# Altium project FIT_PM_TCM_Emulator.PrjPcb (part 1 of 4)
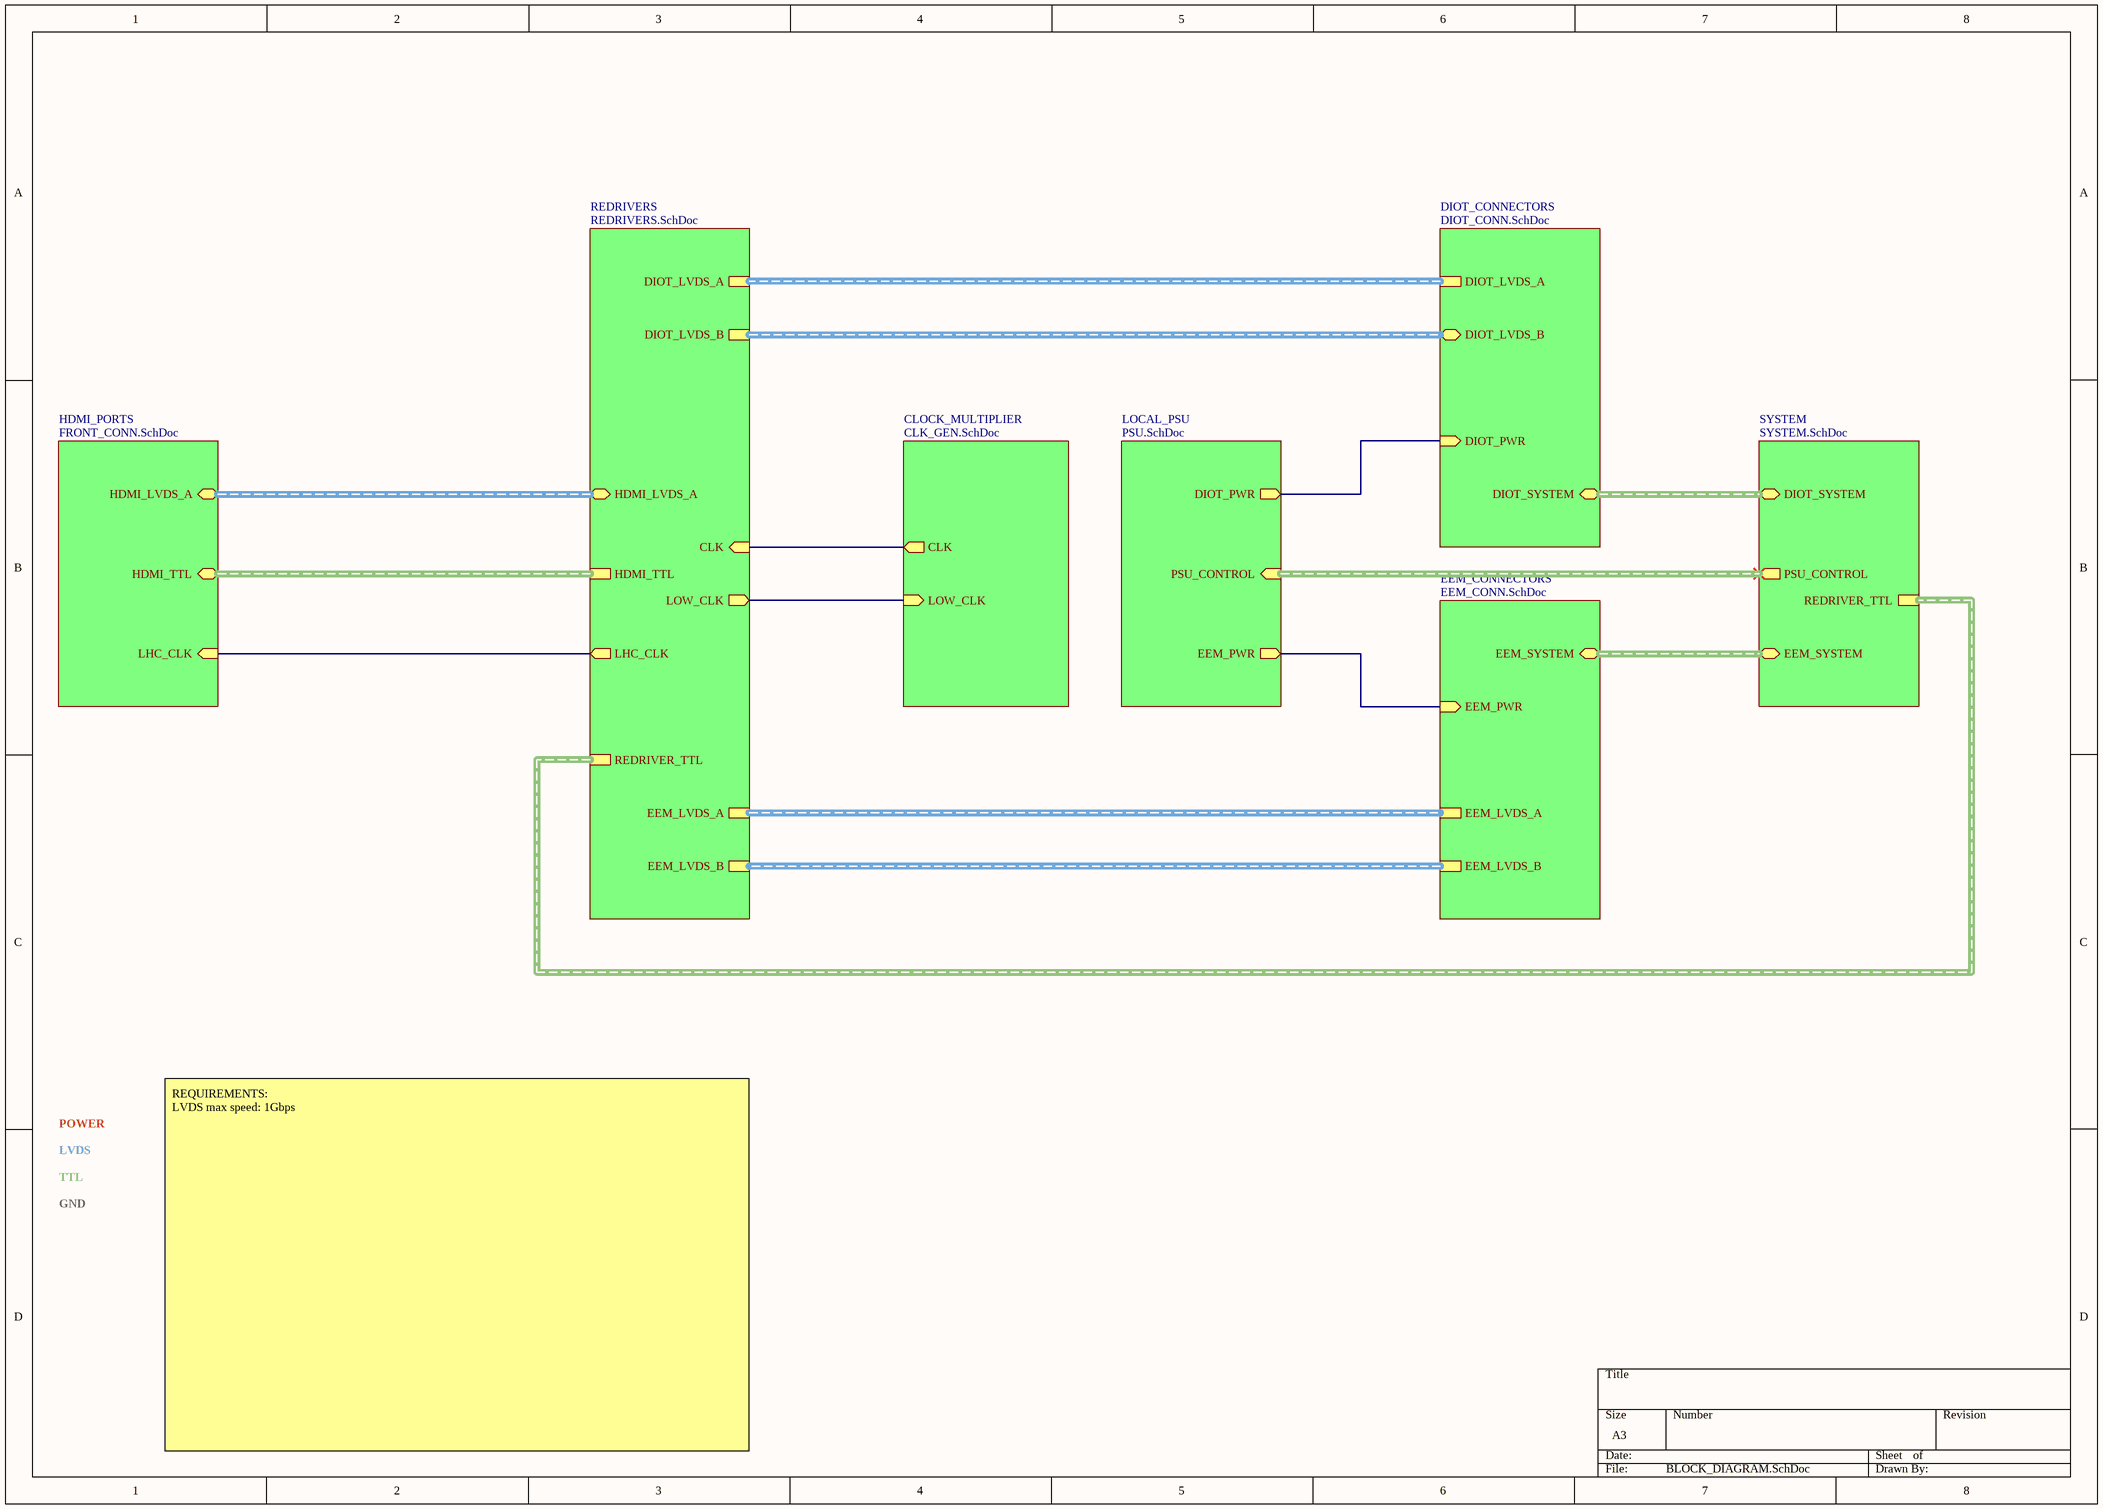
[diagram p0: BLOCK_DIAGRAM.SchDoc]
8 sheets, 255 parts. Net scope: hierarchical (ports join the sheet entries above them; power ports are global).
Board file: LVDS_EXTENDER.PcbDoc
Sheets:
  BLOCK_DIAGRAM.SchDoc
    HDMI_PORTS = FRONT_CONN.SchDoc
    REDRIVERS = REDRIVERS.SchDoc
    DIOT_CONNECTORS = DIOT_CONN.SchDoc
    EEM_CONNECTORS = EEM_CONN.SchDoc
    LOCAL_PSU = PSU.SchDoc
    SYSTEM = SYSTEM.SchDoc
    CLOCK_MULTIPLIER = CLK_GEN.SchDoc

## Sheet BLOCK_DIAGRAM.SchDoc
size A3; SheetNumber: 1; SheetTotal: 8

### Sub-sheets
CLOCK_MULTIPLIER = CLK_GEN.SchDoc: CLK (out), LOW_CLK (in)
DIOT_CONNECTORS = DIOT_CONN.SchDoc: DIOT_SYSTEM (bidir, harness DIOT_SYSTEM), DIOT_LVDS_A (harness DIOT_LVDS_A), DIOT_PWR (in), DIOT_LVDS_B (bidir)
EEM_CONNECTORS = EEM_CONN.SchDoc: EEM_SYSTEM (bidir), EEM_LVDS_B (harness EEM_LVDS), EEM_PWR (in), EEM_LVDS_A (harness EEM_LVDS_A)
HDMI_PORTS = FRONT_CONN.SchDoc: HDMI_LVDS_A (bidir), HDMI_TTL (bidir), LHC_CLK (in)
LOCAL_PSU = PSU.SchDoc: DIOT_PWR (out), EEM_PWR (out), PSU_CONTROL (in)
REDRIVERS = REDRIVERS.SchDoc: EEM_LVDS_B (harness DIOT_LVDS_B), DIOT_LVDS_A (harness DIOT_LVDS_A), HDMI_LVDS_A (bidir), HDMI_TTL, DIOT_LVDS_B (harness DIOT_LVDS_B), EEM_LVDS_A (harness EEM_LVDS_A), REDRIVER_TTL, LHC_CLK (out), CLK (in), LOW_CLK (out)
SYSTEM = SYSTEM.SchDoc: DIOT_SYSTEM (bidir, harness DIOT_SYSTEM), EEM_SYSTEM (bidir), PSU_CONTROL (out), REDRIVER_TTL

### Nets
240MHz: sheet REDRIVERS/CLK, sheet CLOCK_MULTIPLIER/CLK
EEM_12V: sheet EEM_CONNECTORS/EEM_PWR, sheet LOCAL_PSU/EEM_PWR
NetC1_2: sheet DIOT_CONNECTORS/DIOT_PWR, sheet LOCAL_PSU/DIOT_PWR
NetC67_1: sheet REDRIVERS/LOW_CLK, sheet CLOCK_MULTIPLIER/LOW_CLK
NetJ4_1: sheet HDMI_PORTS/LHC_CLK, sheet REDRIVERS/LHC_CLK

### Buses and harness runs
harness sheet DIOT_CONNECTORS/DIOT_LVDS_A = sheet REDRIVERS/DIOT_LVDS_A
harness sheet DIOT_CONNECTORS/DIOT_LVDS_B = sheet REDRIVERS/DIOT_LVDS_B
harness sheet DIOT_CONNECTORS/DIOT_SYSTEM = sheet SYSTEM/DIOT_SYSTEM
harness sheet EEM_CONNECTORS/EEM_LVDS_A = sheet REDRIVERS/EEM_LVDS_A
harness sheet EEM_CONNECTORS/EEM_LVDS_B = sheet REDRIVERS/EEM_LVDS_B
harness sheet EEM_CONNECTORS/EEM_SYSTEM = sheet SYSTEM/EEM_SYSTEM
harness sheet HDMI_PORTS/HDMI_LVDS_A = sheet REDRIVERS/HDMI_LVDS_A
harness sheet HDMI_PORTS/HDMI_TTL = sheet REDRIVERS/HDMI_TTL
harness sheet LOCAL_PSU/PSU_CONTROL = sheet SYSTEM/PSU_CONTROL
harness sheet REDRIVERS/REDRIVER_TTL = sheet SYSTEM/REDRIVER_TTL

### Notes on the sheet
- POWER
- LVDS
- TTL
- GND
- REQUIREMENTS:
  LVDS max speed: 1Gbps

## Sheet FRONT_CONN.SchDoc
size A3; SheetNumber: 3; SheetTotal: 8
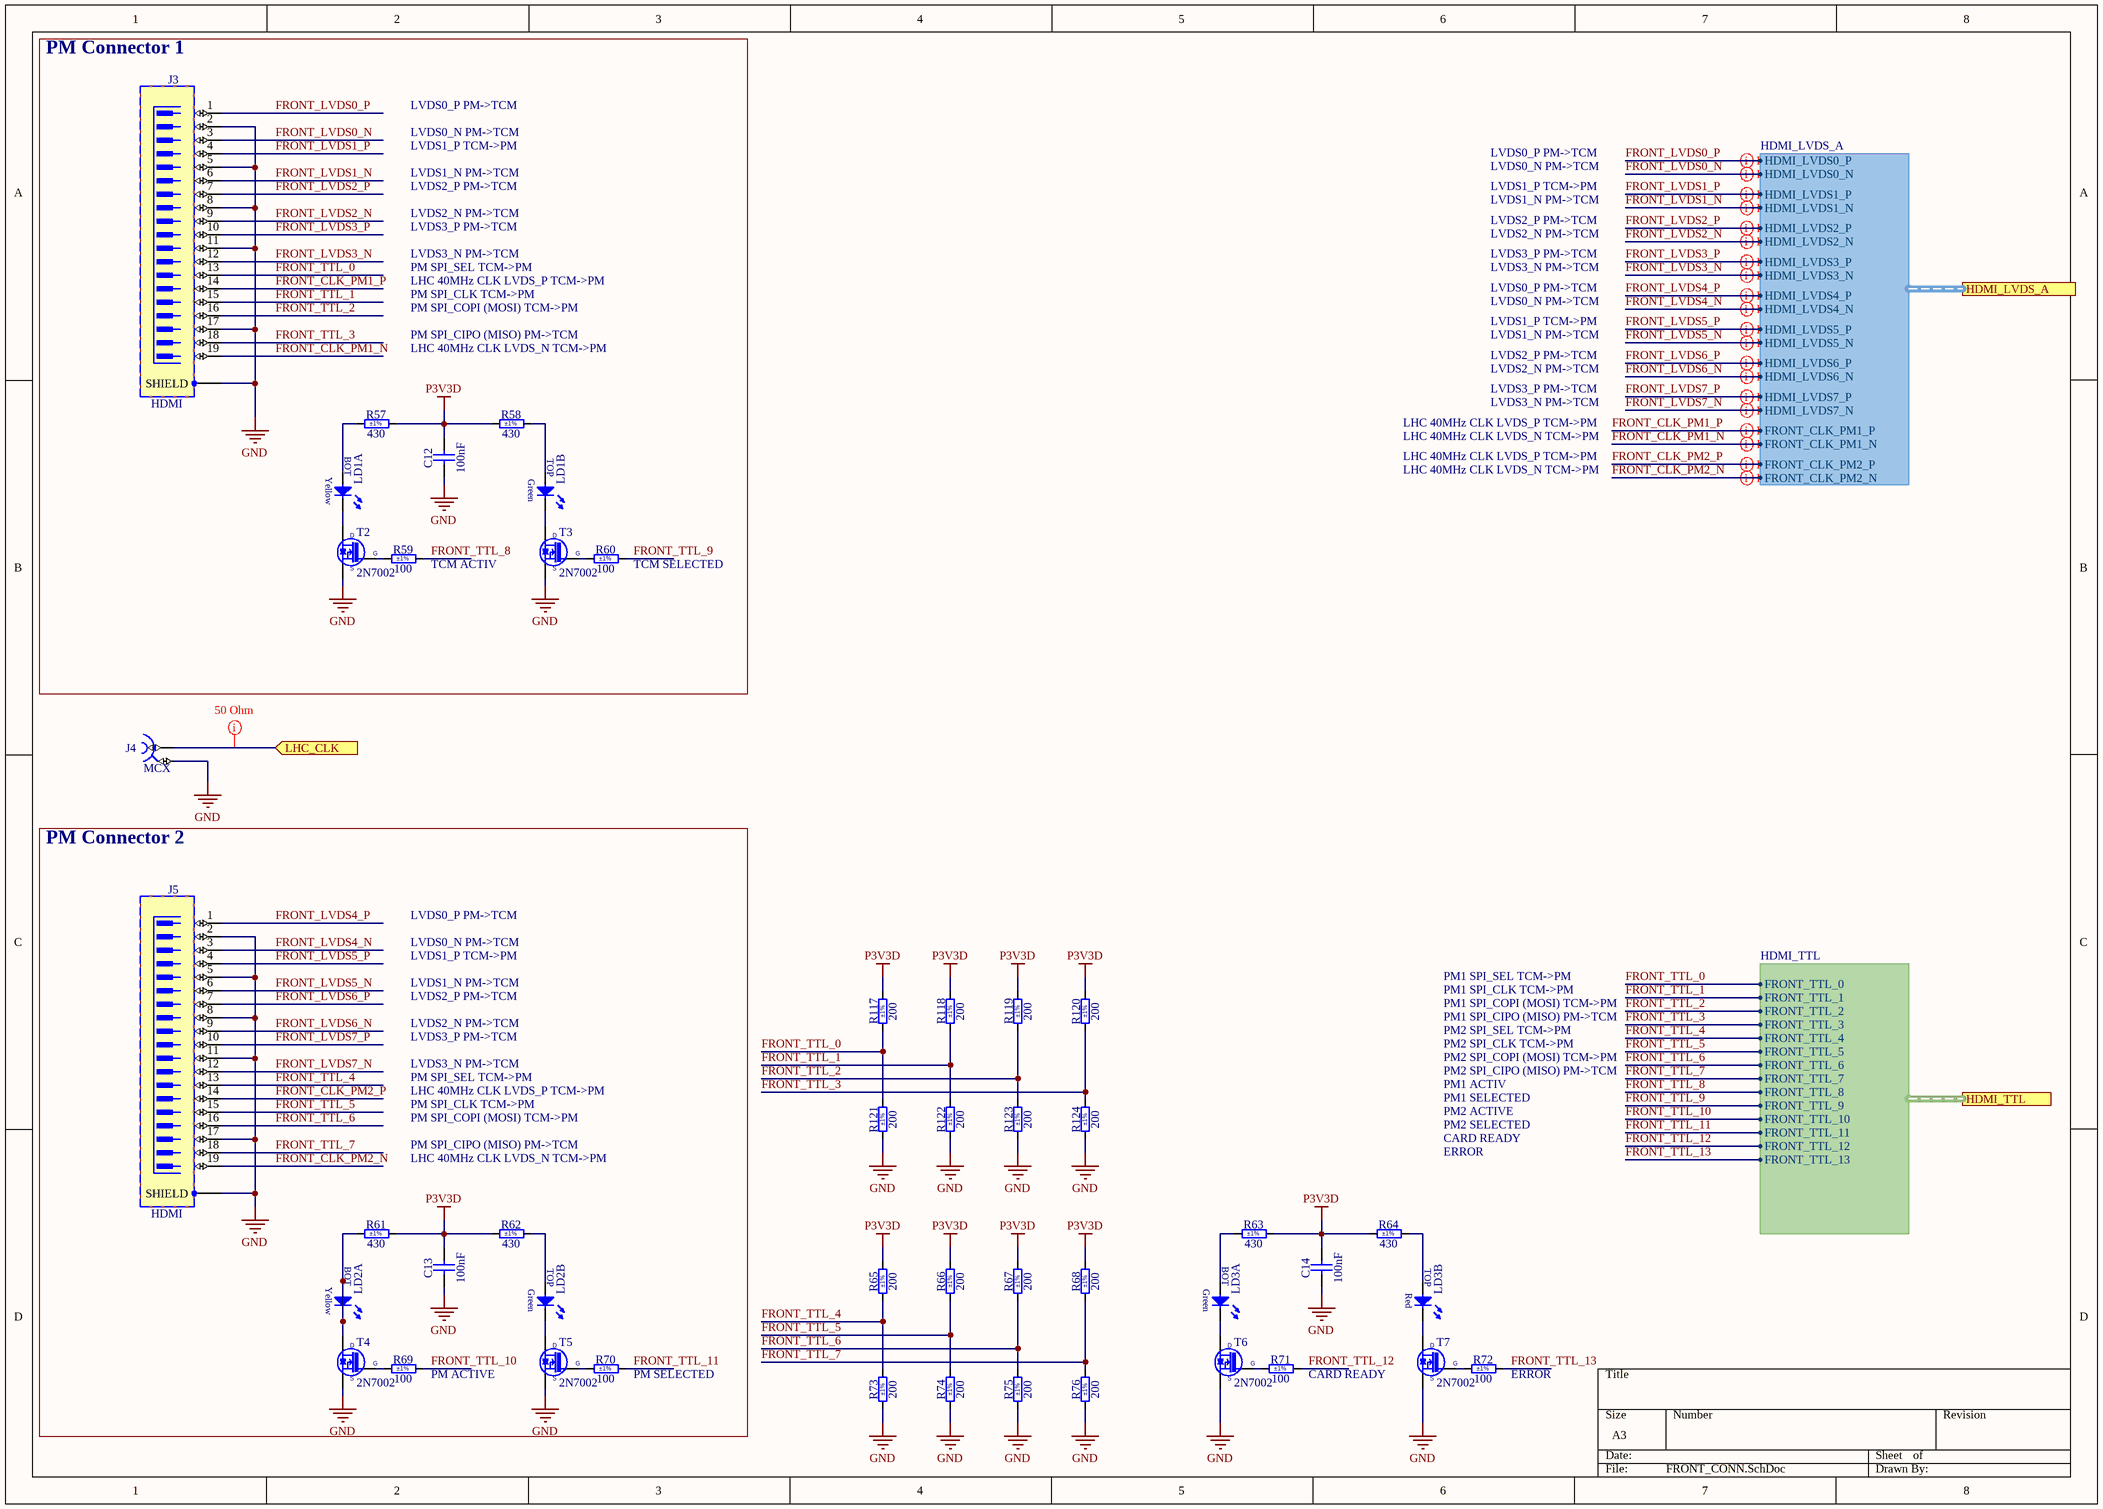
[diagram p1: FRONT_CONN.SchDoc]

### Parts
C12  100nF  [CAPC1608X87N]
C13  100nF  [CAPC1608X87N]
C14  100nF  [CAPC1608X87N]
J3  HDMI  [TYCO_2007435-1]
J4  MCX  [AMPHENOL_919-383J-51A]
J5  HDMI  [TYCO_2007435-1]
LD1  Green/Yellow  [LED_DIALIGHT_571-0123F]  (value not drawn)  (parts A,B of 2)
LD2  Green/Yellow  [LED_DIALIGHT_571-0123F]  (value not drawn)  (parts A,B of 2)
LD3  Red/Green  [LED_DIALIGHT_571-0112-100F]  (value not drawn)  (parts A,B of 2)
R57  430  Tolerance: ±1%  [RESC1608X55N]
R58  430  Tolerance: ±1%  [RESC1608X55N]
R59  100  Tolerance: ±1%  [RESC1608X55N]
R60  100  Tolerance: ±1%  [RESC1608X55N]
R61  430  Tolerance: ±1%  [RESC1608X55N]
R62  430  Tolerance: ±1%  [RESC1608X55N]
R63  430  Tolerance: ±1%  [RESC1608X55N]
R64  430  Tolerance: ±1%  [RESC1608X55N]
R65  200  Tolerance: ±1%  [RESC1608X55N]
R66  200  Tolerance: ±1%  [RESC1608X55N]
R67  200  Tolerance: ±1%  [RESC1608X55N]
R68  200  Tolerance: ±1%  [RESC1608X55N]
R69  100  Tolerance: ±1%  [RESC1608X55N]
R70  100  Tolerance: ±1%  [RESC1608X55N]
R71  100  Tolerance: ±1%  [RESC1608X55N]
R72  100  Tolerance: ±1%  [RESC1608X55N]
R73  200  Tolerance: ±1%  [RESC1608X55N]
R74  200  Tolerance: ±1%  [RESC1608X55N]
R75  200  Tolerance: ±1%  [RESC1608X55N]
R76  200  Tolerance: ±1%  [RESC1608X55N]
R117  200  Tolerance: ±1%  [RESC1608X55N]
R118  200  Tolerance: ±1%  [RESC1608X55N]
R119  200  Tolerance: ±1%  [RESC1608X55N]
R120  200  Tolerance: ±1%  [RESC1608X55N]
R121  200  Tolerance: ±1%  [RESC1608X55N]
R122  200  Tolerance: ±1%  [RESC1608X55N]
R123  200  Tolerance: ±1%  [RESC1608X55N]
R124  200  Tolerance: ±1%  [RESC1608X55N]
T2  2N7002  [SOT95P240X130-3N]
T3  2N7002  [SOT95P240X130-3N]
T4  2N7002  [SOT95P240X130-3N]
T5  2N7002  [SOT95P240X130-3N]
T6  2N7002  [SOT95P240X130-3N]
T7  2N7002  [SOT95P240X130-3N]

### Blocks framed on the sheet
PM Connector 1: C12 J3 LD1 R57-R60 T2 T3
PM Connector 2: C13 J5 LD2 R61 R62 R69 R70 T4 T5

### Ports
HDMI_LVDS_A (harness HDMI_LVDS_A, see BLOCK_DIAGRAM[1B], REDRIVERS[8A]), HDMI_TTL (harness HDMI_TTL, see BLOCK_DIAGRAM[1B], REDRIVERS[8C]), LHC_CLK (in, see BLOCK_DIAGRAM[1B])

### Harnesses
HDMI_TTL: FRONT_TTL_0, FRONT_TTL_1, FRONT_TTL_2, FRONT_TTL_3, FRONT_TTL_4, FRONT_TTL_5, FRONT_TTL_6, FRONT_TTL_7, FRONT_TTL_8, FRONT_TTL_9, FRONT_TTL_10, FRONT_TTL_11, FRONT_TTL_12, FRONT_TTL_13
HDMI_LVDS_A: HDMI_LVDS0_P, HDMI_LVDS0_N, HDMI_LVDS1_P, HDMI_LVDS1_N, HDMI_LVDS2_P, HDMI_LVDS2_N, HDMI_LVDS3_P, HDMI_LVDS3_N, HDMI_LVDS4_P, HDMI_LVDS4_N, HDMI_LVDS5_P, HDMI_LVDS5_N, HDMI_LVDS6_P, HDMI_LVDS6_N, HDMI_LVDS7_P, HDMI_LVDS7_N, FRONT_CLK_PM1_P, FRONT_CLK_PM1_N, FRONT_CLK_PM2_P, FRONT_CLK_PM2_N

### Nets
GND: C12.1 C13.1 C14.1 J3.2 J3.5 J3.8 J3.11 J3.17 J3.SHIELD J4.2 J5.2 J5.5 J5.8 J5.11 J5.17 J5.SHIELD R73.1 R74.1 R75.1 R76.1 R121.1 R122.1 R123.1 R124.1 T2.2(S) T3.2(S) T4.2(S) T5.2(S) T6.2(S) T7.2(S)
P3V3D: C12.2 C13.2 C14.2 R57.2 R58.1 R61.2 R62.1 R63.2 R64.1 R65.2 R66.2 R67.2 R68.2 R117.2 R118.2 R119.2 R120.2
FRONT_CLK_PM1_N: J3.19 ; port HDMI_LVDS_A.FRONT_CLK_PM1_N
FRONT_CLK_PM1_P: J3.14 ; port HDMI_LVDS_A.FRONT_CLK_PM1_P
FRONT_CLK_PM2_N: J5.19 ; port HDMI_LVDS_A.FRONT_CLK_PM2_N
FRONT_CLK_PM2_P: J5.14 ; port HDMI_LVDS_A.FRONT_CLK_PM2_P
FRONT_LVDS0_N: J3.3 ; port HDMI_LVDS_A.HDMI_LVDS0_N
FRONT_LVDS0_P: J3.1 ; port HDMI_LVDS_A.HDMI_LVDS0_P
FRONT_LVDS1_N: J3.6 ; port HDMI_LVDS_A.HDMI_LVDS1_N
FRONT_LVDS1_P: J3.4 ; port HDMI_LVDS_A.HDMI_LVDS1_P
FRONT_LVDS2_N: J3.9 ; port HDMI_LVDS_A.HDMI_LVDS2_N
FRONT_LVDS2_P: J3.7 ; port HDMI_LVDS_A.HDMI_LVDS2_P
FRONT_LVDS3_N: J3.12 ; port HDMI_LVDS_A.HDMI_LVDS3_N
FRONT_LVDS3_P: J3.10 ; port HDMI_LVDS_A.HDMI_LVDS3_P
FRONT_LVDS4_N: J5.3 ; port HDMI_LVDS_A.HDMI_LVDS4_N
FRONT_LVDS4_P: J5.1 ; port HDMI_LVDS_A.HDMI_LVDS4_P
FRONT_LVDS5_N: J5.6 ; port HDMI_LVDS_A.HDMI_LVDS5_N
FRONT_LVDS5_P: J5.4 ; port HDMI_LVDS_A.HDMI_LVDS5_P
FRONT_LVDS6_N: J5.9 ; port HDMI_LVDS_A.HDMI_LVDS6_N
FRONT_LVDS6_P: J5.7 ; port HDMI_LVDS_A.HDMI_LVDS6_P
FRONT_LVDS7_N: J5.12 ; port HDMI_LVDS_A.HDMI_LVDS7_N
FRONT_LVDS7_P: J5.10 ; port HDMI_LVDS_A.HDMI_LVDS7_P
FRONT_TTL_0: J3.13 R117.1 R121.2 ; port HDMI_TTL.FRONT_TTL_0
FRONT_TTL_1: J3.15 R118.1 R122.2 ; port HDMI_TTL.FRONT_TTL_1
FRONT_TTL_2: J3.16 R119.1 R123.2 ; port HDMI_TTL.FRONT_TTL_2
FRONT_TTL_3: J3.18 R120.1 R124.2 ; port HDMI_TTL.FRONT_TTL_3
FRONT_TTL_4: J5.13 R65.1 R73.2 ; port HDMI_TTL.FRONT_TTL_4
FRONT_TTL_5: J5.15 R66.1 R74.2 ; port HDMI_TTL.FRONT_TTL_5
FRONT_TTL_6: J5.16 R67.1 R75.2 ; port HDMI_TTL.FRONT_TTL_6
FRONT_TTL_7: J5.18 R68.1 R76.2 ; port HDMI_TTL.FRONT_TTL_7
FRONT_TTL_8: R59.2 ; port HDMI_TTL.FRONT_TTL_8
FRONT_TTL_9: R60.2 ; port HDMI_TTL.FRONT_TTL_9
FRONT_TTL_10: R69.2 ; port HDMI_TTL.FRONT_TTL_10
FRONT_TTL_11: R70.2 ; port HDMI_TTL.FRONT_TTL_11
FRONT_TTL_12: R71.2 ; port HDMI_TTL.FRONT_TTL_12
FRONT_TTL_13: R72.2 ; port HDMI_TTL.FRONT_TTL_13
NetJ4_1: J4.1 ; port LHC_CLK
NetLD1_1: LD1.1(C) T2.3(D)
NetLD1_2: LD1.2(A) R57.1
NetLD1_3: LD1.3(C) T3.3(D)
NetLD1_4: LD1.4(A) R58.2
NetLD2_1: LD2.1(C) LD2.2(A) R61.1 T4.3(D)
NetLD2_3: LD2.3(C) T5.3(D)
NetLD2_4: LD2.4(A) R62.2
NetLD3_1: LD3.1(C) T6.3(D)
NetLD3_2: LD3.2(A) R63.1
NetLD3_3: LD3.3(C) T7.3(D)
NetLD3_4: LD3.4(A) R64.2
NetR59_1: R59.1 T2.1(G)
NetR60_1: R60.1 T3.1(G)
NetR69_1: R69.1 T4.1(G)
NetR70_1: R70.1 T5.1(G)
NetR71_1: R71.1 T6.1(G)
NetR72_1: R72.1 T7.1(G)

### Layout directives
differential pair; net class LVDS; differential pair class LVDS_DIFF: FRONT_CLK_PM1_N, FRONT_CLK_PM1_P, FRONT_CLK_PM2_N, FRONT_CLK_PM2_P, FRONT_LVDS0_N, FRONT_LVDS0_P, FRONT_LVDS1_N, FRONT_LVDS1_P, FRONT_LVDS2_N, FRONT_LVDS2_P, FRONT_LVDS3_N, FRONT_LVDS3_P, FRONT_LVDS4_N, FRONT_LVDS4_P, FRONT_LVDS5_N, FRONT_LVDS5_P, FRONT_LVDS6_N, FRONT_LVDS6_P, FRONT_LVDS7_N, FRONT_LVDS7_P
net class CLK: NetJ4_1

### Notes on the sheet
- LVDS0_P PM->TCM
- LVDS0_N PM->TCM
- LVDS1_P TCM->PM
- LVDS1_N PM->TCM
- LVDS2_P PM->TCM
- LVDS2_N PM->TCM
- LVDS3_P PM->TCM
- LVDS3_N PM->TCM
- PM SPI_SEL TCM->PM
- LHC 40MHz CLK LVDS_P TCM->PM
- PM SPI_CLK TCM->PM
- PM SPI_COPI (MOSI) TCM->PM
- PM SPI_CIPO (MISO) PM->TCM
- LHC 40MHz CLK LVDS_N TCM->PM
- (near R59) TCM ACTIV
- (near R60) TCM SELECTED
- PM1 SPI_SEL TCM->PM
- PM1 SPI_CLK TCM->PM
- PM1 SPI_COPI (MOSI) TCM->PM
- PM1 SPI_CIPO (MISO) PM->TCM
- PM2 SPI_SEL TCM->PM
- PM2 SPI_CLK TCM->PM
- PM1 ACTIV
- PM1 SELECTED
- PM2 ACTIVE
- PM2 SELECTED
- PM2 SPI_COPI (MOSI) TCM->PM
- PM2 SPI_CIPO (MISO) PM->TCM
- CARD READY
- ERROR
- (near R69) PM ACTIVE
- (near R70) PM SELECTED
- (near R71) CARD READY
- (near R72) ERROR
- (in symbol LED_DIALIGHT_571-0112-100F, part A) BOT; Green
- (in symbol LED_DIALIGHT_571-0112-100F, part B) TOP; Red
- (in symbol LED_DIALIGHT_571-0123F, part A) BOT; Yellow
- (in symbol LED_DIALIGHT_571-0123F, part B) TOP; Green

### Library data of the parts
C12-C14 = CC0603_100NF_50V_10%_X7R: Non-polarised capacitor; Part Description: SMD Multilayer Chip Ceramic Capacitor; Manufacturer: GENERIC; Manufacturer1 Part Number: 223858615649; Voltage: 50V; TC: X7R; Tolerance: ±10%; Part Number: CC0603_100NF_50V_10%_X7R; Component Kind: Standard; Component Type: Standard; Pin Count: 2; Value: 100nF; Status: Preferred; Manufacturer Part Number: CC0603_100NF_50V_10%_X7R; Case: 0603; Mounted: Yes; Socket: No; SMD: Yes; Sense: No; Manufacturer1 Example: PHYCOMP; Manufacturer1 ComponentHeight: 0.87mm; HelpURL: \\cern.ch\dfs\Applications\Altium\Datasheets\CC0603_X7R_PHYCOMP.pdf; Author: CERN DEM JLC; CreateDate: 03.12.2007; LatestRevisionDate: 03.12.2007
J3 J5 = TYCO_2007435-1: Connector HDMI 19 Male + 1 Shield; Part Description: 0.578mm Pitch, Through-Hole Right Angle 19 Contacts Flag-HDMI Type-A Receptacle Thru Hole Mounting Pads; Manufacturer: TYCO ELECTRONICS; PressFit: No; Part Number: TYCO_2007435-1; Component Kind: Standard; Component Type: Standard; Pin Count: 23; Family: HDMI; Mounted: Yes; Socket: No; SMD: No; Sense: No; Status: None; Manufacturer Part Number: 2007435-1; ComponentHeight: 16.4mm; HelpURL: \\cern.ch\dfs\Applications\Altium\Datasheets\TYCO_2007435-1.pdf; Author: CERN DEM MR; CreateDate: 05.07.2016; LatestRevisionDate: 05.07.2016
J4 = AMPHENOL_919-383J-51A: Part Description: 50 Ohms, RF Connector, MCX Right Angle PCB Receptacle Jack; PressFit: No; Part Number: AMPHENOL_919-383J-51A; Component Kind: Standard; Component Type: Standard; Pin Count: 5; Family: MCX; Mounted: Yes; Socket: No; SMD: No; Sense: No; Status: None; Manufacturer: AMPHENOL; Manufacturer Part Number: 919-383J-51A; ComponentHeight: 6mm; HelpURL: \\cern.ch\dfs\Applications\Altium\Datasheets\AMPHENOL_919-383J-51A.pdf; Author: CERN DEM BC; CreateDate: 31.01.2019; LatestRevisionDate: 31.01.2019
LD1 LD2 = LED_DIALIGHT_571-0123F: 2x LED  Botom Yellow, Top Green; Part Description: Dual 2mm  LEDs, Green Top, Yellow Bot, CBI® Circuit Board Indicator (without positioning pins); PressFit: No; Bonding: No; Part Number: LED_DIALIGHT_571-0123F; Component Kind: Standard; Component Type: Standard; Color: Green/Yellow; PackageDescription: 2x 2mm LED (Top: Green, Bot: Yellow) PCB Edge Mounting (without positioning pins) DIALIGHT 571 Serie; Manufacturer: DIALIGHT; Manufacturer Part Number: 571-0123F; Pin Count: 4; Mounted: Yes; Socket: No; SMD: No; Sense: No; ComponentHeight: 8.6mm; HelpURL: \\cern.ch\dfs\Applications\Altium\Datasheets\LED_DIALIGHT_571-0123F.pdf; Author: CERN DEM JLC; CreateDate: 17.07.2014; LatestRevisionDate: 17.07.2014
LD3 = LED_DIALIGHT_571-0112-100F: 2x LED Botom Green, Top Red; Part Description: Dual 2mm  LEDs, Red Top,Green Bot, CBI® Circuit Board Indicator (with positioning pins); PressFit: No; Bonding: No; Part Number: LED_DIALIGHT_571-0112-100F; Component Kind: Standard; Component Type: Standard; Color: Red/Green; PackageDescription: 2x 2mm LED (Top: Red, Bot: Green) PCB Edge Mounting (with positioning pins) DIALIGHT 571 Serie; Manufacturer: DIALIGHT; Manufacturer Part Number: 571-0112-100F; Pin Count: 4; Mounted: Yes; Socket: No; SMD: No; Sense: No; ComponentHeight: 8.6mm; HelpURL: \\cern.ch\dfs\Applications\Altium\Datasheets\LED_DIALIGHT_571-0112-100F.pdf; Author: CERN DEM JLC; CreateDate: 05.11.2009; LatestRevisionDate: 17.03.2010
R57 R58 R61-R64 = R0603_430R_1%_0.1W_100PPM: Resistor - 1%; Part Description: General Purpose Thick Film Chip Resistor; Manufacturer: GENERIC; Manufacturer1 Part Number: NRC06F4300TRF; Power: 0.1W; TC: ±100ppm/°C; PressFit: No; Part Number: R0603_430R_1%_0.1W_100PPM; Component Kind: Standard; Component Type: Standard; Pin Count: 2; Value: 430; Status: Preferred; Manufacturer Part Number: R0603_430R_1%_0.1W_100PPM; Case: 0603; Mounted: Yes; Sense: No; Socket: No; SMD: Yes; Manufacturer1 Example: NIC COMPONENT; Manufacturer1 ComponentHeight: 0.55mm; HelpURL: \\cern.ch\dfs\Applications\Altium\Datasheets\R0603_NIC_NRC.pdf; Author: CERN DEM JLC; CreateDate: 03.12.2007; LatestRevisionDate: 13.03.2008
R59 R60 R69-R72 = R0603_100R_1%_0.1W_100PPM: Resistor - 1%; Part Description: General Purpose Thick Film Chip Resistor; Manufacturer: GENERIC; Manufacturer1 Part Number: NRC06F4700TRF; Power: 0.1W; TC: ±100ppm/°C; PressFit: No; Part Number: R0603_100R_1%_0.1W_100PPM; Component Kind: Standard; Component Type: Standard; Pin Count: 2; Value: 100; Status: Preferred; Manufacturer Part Number: R0603_100R_1%_0.1W_100PPM; Case: 0603; Mounted: Yes; Sense: No; Socket: No; SMD: Yes; Manufacturer1 Example: NIC COMPONENT; Manufacturer1 ComponentHeight: 0.55mm; HelpURL: \\cern.ch\dfs\Applications\Altium\Datasheets\R0603_NIC_NRC.pdf; Author: CERN DEM JLC; CreateDate: 03.12.2007; LatestRevisionDate: 13.03.2008
R65-R68 R73-R76 R117-R124 = R0603_200R_1%_0.1W_100PPM: Resistor - 1%; Part Description: General Purpose Thick Film Chip Resistor; Manufacturer: GENERIC; Manufacturer1 Part Number: NRC06F2000TRF; Power: 0.1W; TC: ±100ppm/°C; PressFit: No; Part Number: R0603_200R_1%_0.1W_100PPM; Component Kind: Standard; Component Type: Standard; Pin Count: 2; Value: 200; Status: Preferred; Manufacturer Part Number: R0603_200R_1%_0.1W_100PPM; Case: 0603; Mounted: Yes; Sense: No; Socket: No; SMD: Yes; Manufacturer1 Example: NIC COMPONENT; Manufacturer1 ComponentHeight: 0.55mm; HelpURL: \\cern.ch\dfs\Applications\Altium\Datasheets\R0603_NIC_NRC.pdf; Author: CERN DEM JLC; CreateDate: 03.12.2007; LatestRevisionDate: 13.03.2008
T2-T7 = 2N7002: N-CHANNEL MOSFET WITH DIODE; Part Description: 60V, 280mA, N-Channel Enhancement Mode Field Effect Transistor (FET); Manufacturer: FAIRCHILD SEMICONDUCTOR; PressFit: No; Bonding: No; Part Number: 2N7002; Component Kind: Standard; Component Type: Standard; Device: 2N7002; PackageDescription: SOT23, 0.95mm Pitch; 3 Pin, 1.30mm W X 2.90mm L X 1.30mm H body, IPC Medium Density; Manufacturer Part Number: 2N7002; Pin Count: 3; Case: SOT23-3; Mounted: Yes; Socket: No; SMD: Yes; Sense: No; ComponentHeight: 1.3mm; HelpURL: \\cern.ch\dfs\Applications\Altium\Datasheets\2N7002.pdf; Author: CERN DEM JLC; CreateDate: 20.08.2008; LatestRevisionDate: 07.04.2009

## Sheet REDRIVERS.SchDoc
size A3; SheetNumber: 6; SheetTotal: 8
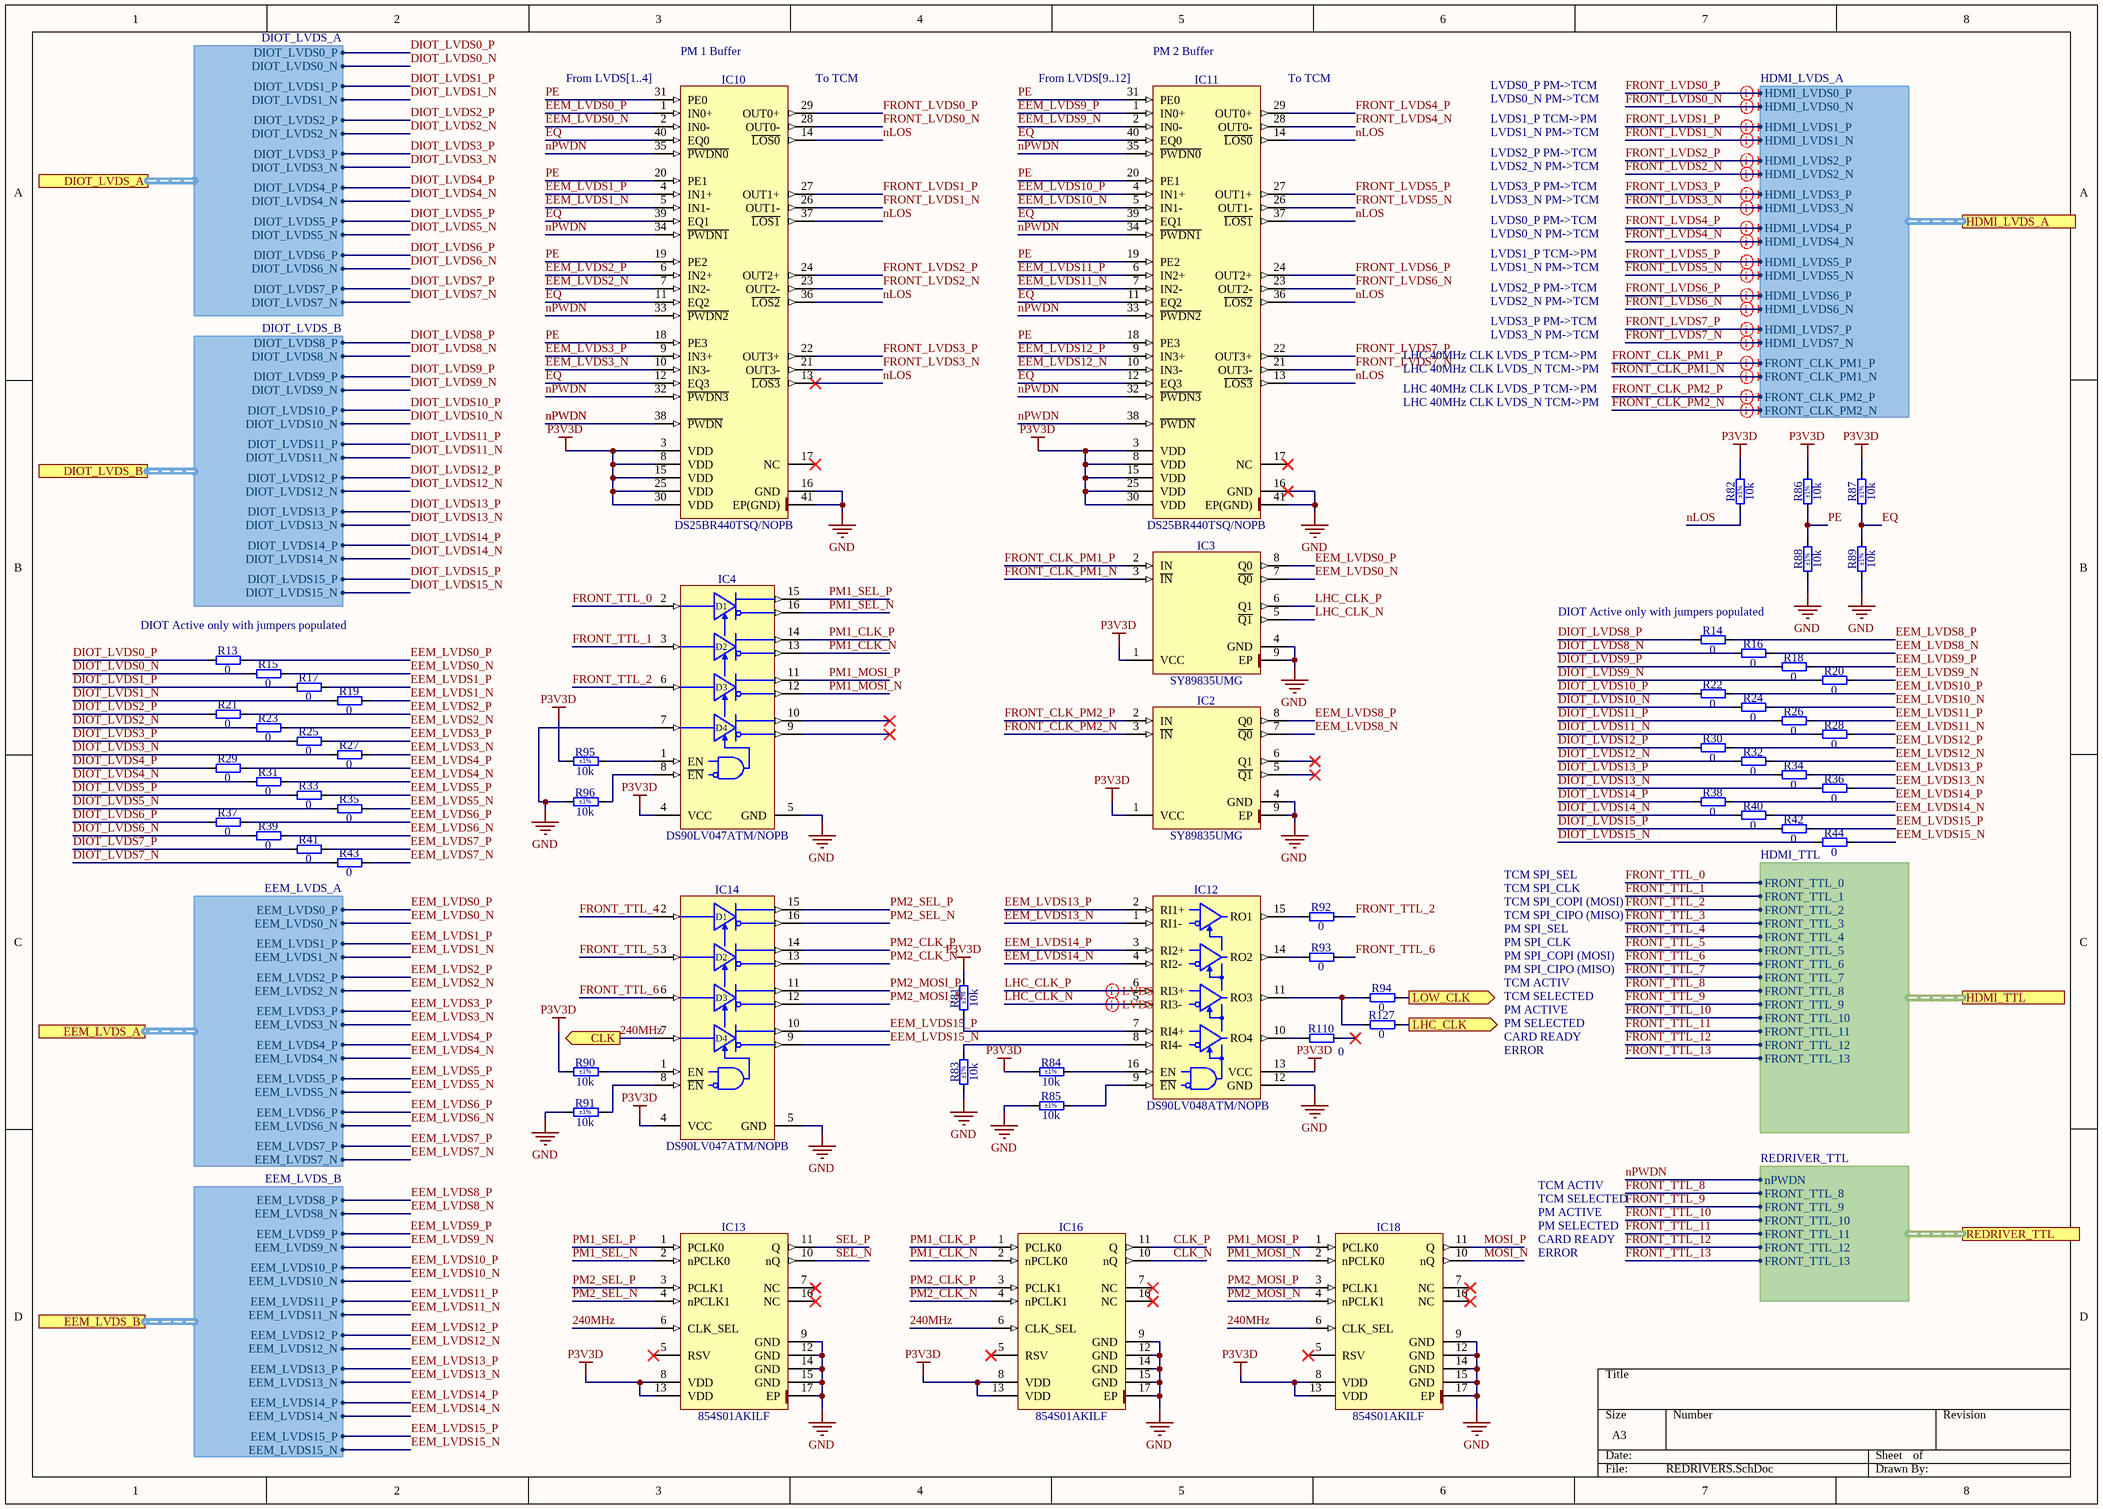
[diagram p2: REDRIVERS.SchDoc]

### Parts
IC2  SY89835UMG  [SON50P200X200X90-9N-R70X130]
IC3  SY89835UMG  [SON50P200X200X90-9N-R70X130]
IC4  DS90LV047ATM/NOPB  [SOIC127P600X175-16N]
IC10  DS25BR440TSQ/NOPB  [QFN50P600X600X80-41N-S480]
IC11  DS25BR440TSQ/NOPB  [QFN50P600X600X80-41N-S480]
IC12  DS90LV048ATM/NOPB  [SOIC127P600X175-16N]
IC13  854S01AKILF  [QFN50P300X300X100-17N-S180]
IC14  DS90LV047ATM/NOPB  [SOIC127P600X175-16N]
IC16  854S01AKILF  [QFN50P300X300X100-17N-S180]
IC18  854S01AKILF  [QFN50P300X300X100-17N-S180]
R13  0  [RESC1005X40N]
R14  0  [RESC1005X40N]
R15  0  [RESC1005X40N]
R16  0  [RESC1005X40N]
R17  0  [RESC1005X40N]
R18  0  [RESC1005X40N]
R19  0  [RESC1005X40N]
R20  0  [RESC1005X40N]
R21  0  [RESC1005X40N]
R22  0  [RESC1005X40N]
R23  0  [RESC1005X40N]
R24  0  [RESC1005X40N]
R25  0  [RESC1005X40N]
R26  0  [RESC1005X40N]
R27  0  [RESC1005X40N]
R28  0  [RESC1005X40N]
R29  0  [RESC1005X40N]
R30  0  [RESC1005X40N]
R31  0  [RESC1005X40N]
R32  0  [RESC1005X40N]
R33  0  [RESC1005X40N]
R34  0  [RESC1005X40N]
R35  0  [RESC1005X40N]
R36  0  [RESC1005X40N]
R37  0  [RESC1005X40N]
R38  0  [RESC1005X40N]
R39  0  [RESC1005X40N]
R40  0  [RESC1005X40N]
R41  0  [RESC1005X40N]
R42  0  [RESC1005X40N]
R43  0  [RESC1005X40N]
R44  0  [RESC1005X40N]
R81  10k  Tolerance: ±1%  [RESC1608X55N]
R82  10k  Tolerance: ±1%  [RESC1608X55N]
R83  10k  Tolerance: ±1%  [RESC1608X55N]
R84  10k  Tolerance: ±1%  [RESC1608X55N]
R85  10k  Tolerance: ±1%  [RESC1608X55N]
R86  10k  Tolerance: ±1%  [RESC1608X55N]
R87  10k  Tolerance: ±1%  [RESC1608X55N]
R88  10k  Tolerance: ±1%  [RESC1608X55N]
R89  10k  Tolerance: ±1%  [RESC1608X55N]
R90  10k  Tolerance: ±1%  [RESC1608X55N]
R91  10k  Tolerance: ±1%  [RESC1608X55N]
R92  0  [RESC1005X40N]
R93  0  [RESC1005X40N]
R94  0  [RESC1005X40N]
R95  10k  Tolerance: ±1%  [RESC1608X55N]
R96  10k  Tolerance: ±1%  [RESC1608X55N]
R110  0  [RESC1005X40N]
R127  0  [RESC1005X40N]

### Ports
CLK (out, see BLOCK_DIAGRAM[3B], CLK_GEN[6B]), DIOT_LVDS_A (harness DIOT_LVDS_A, see BLOCK_DIAGRAM[3A], DIOT_CONN[3C]), DIOT_LVDS_B (harness DIOT_LVDS_B, see BLOCK_DIAGRAM[3A], DIOT_CONN[6C]), EEM_LVDS_A (harness EEM_LVDS_A, see BLOCK_DIAGRAM[3C], EEM_CONN[3A]), EEM_LVDS_B (harness EEM_LVDS_B, see BLOCK_DIAGRAM[3C], EEM_CONN[6A]), HDMI_LVDS_A (harness HDMI_LVDS_A, see BLOCK_DIAGRAM[3B], FRONT_CONN[8A]), HDMI_TTL (harness HDMI_TTL, see BLOCK_DIAGRAM[3B], FRONT_CONN[8C]), LHC_CLK (out, see BLOCK_DIAGRAM[3B], FRONT_CONN[2B]), LOW_CLK (out, see BLOCK_DIAGRAM[3B], CLK_GEN[2B]), REDRIVER_TTL (harness REDRIVER_TTL, see BLOCK_DIAGRAM[3C], SYSTEM[1D])

### Harnesses
DIOT_LVDS_A: DIOT_LVDS0_P, DIOT_LVDS0_N, DIOT_LVDS1_P, DIOT_LVDS1_N, DIOT_LVDS2_P, DIOT_LVDS2_N, DIOT_LVDS3_P, DIOT_LVDS3_N, DIOT_LVDS4_P, DIOT_LVDS4_N, DIOT_LVDS5_P, DIOT_LVDS5_N, DIOT_LVDS6_P, DIOT_LVDS6_N, DIOT_LVDS7_P, DIOT_LVDS7_N
DIOT_LVDS_B: DIOT_LVDS8_P, DIOT_LVDS8_N, DIOT_LVDS9_P, DIOT_LVDS9_N, DIOT_LVDS10_P, DIOT_LVDS10_N, DIOT_LVDS11_P, DIOT_LVDS11_N, DIOT_LVDS12_P, DIOT_LVDS12_N, DIOT_LVDS13_P, DIOT_LVDS13_N, DIOT_LVDS14_P, DIOT_LVDS14_N, DIOT_LVDS15_P, DIOT_LVDS15_N
EEM_LVDS_A: EEM_LVDS0_P, EEM_LVDS0_N, EEM_LVDS1_P, EEM_LVDS1_N, EEM_LVDS2_P, EEM_LVDS2_N, EEM_LVDS3_P, EEM_LVDS3_N, EEM_LVDS4_P, EEM_LVDS4_N, EEM_LVDS5_P, EEM_LVDS5_N, EEM_LVDS6_P, EEM_LVDS6_N, EEM_LVDS7_P, EEM_LVDS7_N
EEM_LVDS_B: EEM_LVDS8_P, EEM_LVDS8_N, EEM_LVDS9_P, EEM_LVDS9_N, EEM_LVDS10_P, EEM_LVDS10_N, EEM_LVDS11_P, EEM_LVDS11_N, EEM_LVDS12_P, EEM_LVDS12_N, EEM_LVDS13_P, EEM_LVDS13_N, EEM_LVDS14_P, EEM_LVDS14_N, EEM_LVDS15_P, EEM_LVDS15_N
REDRIVER_TTL: nPWDN, FRONT_TTL_8, FRONT_TTL_9, FRONT_TTL_10, FRONT_TTL_11, FRONT_TTL_12, FRONT_TTL_13
HDMI_LVDS_A: HDMI_LVDS0_P, HDMI_LVDS0_N, HDMI_LVDS1_P, HDMI_LVDS1_N, HDMI_LVDS2_P, HDMI_LVDS2_N, HDMI_LVDS3_P, HDMI_LVDS3_N, HDMI_LVDS4_P, HDMI_LVDS4_N, HDMI_LVDS5_P, HDMI_LVDS5_N, HDMI_LVDS6_P, HDMI_LVDS6_N, HDMI_LVDS7_P, HDMI_LVDS7_N, FRONT_CLK_PM1_P, FRONT_CLK_PM1_N, FRONT_CLK_PM2_P, FRONT_CLK_PM2_N
HDMI_TTL: FRONT_TTL_0, FRONT_TTL_1, FRONT_TTL_2, FRONT_TTL_3, FRONT_TTL_4, FRONT_TTL_5, FRONT_TTL_6, FRONT_TTL_7, FRONT_TTL_8, FRONT_TTL_9, FRONT_TTL_10, FRONT_TTL_11, FRONT_TTL_12, FRONT_TTL_13

### Nets
GND: IC2.4(GND) IC2.9(EP) IC3.4(GND) IC3.9(EP) IC4.5(GND) IC4.7(DIN4) IC10.16(GND) IC10.41(EP(GND)) IC11.16(GND) IC11.41(EP(GND)) IC12.12(GND) IC13.9(GND) IC13.12(GND) IC13.14(GND) IC13.15(GND) IC13.17(EP) IC14.5(GND) IC16.9(GND) IC16.12(GND) IC16.14(GND) IC16.15(GND) IC16.17(EP) IC18.9(GND) IC18.12(GND) IC18.14(GND) IC18.15(GND) IC18.17(EP) R83.1 R85.1 R88.1 R89.1 R91.2 R96.2
P3V3D: IC2.1(VCC) IC3.1(VCC) IC4.4(VCC) IC10.3(VDD) IC10.8(VDD) IC10.15(VDD) IC10.25(VDD) IC10.30(VDD) IC11.3(VDD) IC11.8(VDD) IC11.15(VDD) IC11.25(VDD) IC11.30(VDD) IC12.13(VCC) IC13.8(VDD) IC13.13(VDD) IC14.4(VCC) IC16.8(VDD) IC16.13(VDD) IC18.8(VDD) IC18.13(VDD) R81.2 R82.2 R84.1 R86.2 R87.2 R90.2 R95.2
240MHz: IC13.6(CLK_SEL) IC14.7(DIN4) IC16.6(CLK_SEL) IC18.6(CLK_SEL) ; port CLK
CLK_N: IC16.10(nQ)
CLK_P: IC16.11(Q)
DIOT_LVDS0_N: R15.1 ; port DIOT_LVDS_A.DIOT_LVDS0_N
DIOT_LVDS0_P: R13.1 ; port DIOT_LVDS_A.DIOT_LVDS0_P
DIOT_LVDS1_N: R19.1 ; port DIOT_LVDS_A.DIOT_LVDS1_N
DIOT_LVDS1_P: R17.1 ; port DIOT_LVDS_A.DIOT_LVDS1_P
DIOT_LVDS2_N: R23.1 ; port DIOT_LVDS_A.DIOT_LVDS2_N
DIOT_LVDS2_P: R21.1 ; port DIOT_LVDS_A.DIOT_LVDS2_P
DIOT_LVDS3_N: R27.1 ; port DIOT_LVDS_A.DIOT_LVDS3_N
DIOT_LVDS3_P: R25.1 ; port DIOT_LVDS_A.DIOT_LVDS3_P
DIOT_LVDS4_N: R31.1 ; port DIOT_LVDS_A.DIOT_LVDS4_N
DIOT_LVDS4_P: R29.1 ; port DIOT_LVDS_A.DIOT_LVDS4_P
DIOT_LVDS5_N: R35.1 ; port DIOT_LVDS_A.DIOT_LVDS5_N
DIOT_LVDS5_P: R33.1 ; port DIOT_LVDS_A.DIOT_LVDS5_P
DIOT_LVDS6_N: R39.1 ; port DIOT_LVDS_A.DIOT_LVDS6_N
DIOT_LVDS6_P: R37.1 ; port DIOT_LVDS_A.DIOT_LVDS6_P
DIOT_LVDS7_N: R43.1 ; port DIOT_LVDS_A.DIOT_LVDS7_N
DIOT_LVDS7_P: R41.1 ; port DIOT_LVDS_A.DIOT_LVDS7_P
DIOT_LVDS8_N: R16.1 ; port DIOT_LVDS_B.DIOT_LVDS8_N
DIOT_LVDS8_P: R14.1 ; port DIOT_LVDS_B.DIOT_LVDS8_P
DIOT_LVDS9_N: R20.1 ; port DIOT_LVDS_B.DIOT_LVDS9_N
DIOT_LVDS9_P: R18.1 ; port DIOT_LVDS_B.DIOT_LVDS9_P
DIOT_LVDS10_N: R24.1 ; port DIOT_LVDS_B.DIOT_LVDS10_N
DIOT_LVDS10_P: R22.1 ; port DIOT_LVDS_B.DIOT_LVDS10_P
DIOT_LVDS11_N: R28.1 ; port DIOT_LVDS_B.DIOT_LVDS11_N
DIOT_LVDS11_P: R26.1 ; port DIOT_LVDS_B.DIOT_LVDS11_P
DIOT_LVDS12_N: R32.1 ; port DIOT_LVDS_B.DIOT_LVDS12_N
DIOT_LVDS12_P: R30.1 ; port DIOT_LVDS_B.DIOT_LVDS12_P
DIOT_LVDS13_N: R36.1 ; port DIOT_LVDS_B.DIOT_LVDS13_N
DIOT_LVDS13_P: R34.1 ; port DIOT_LVDS_B.DIOT_LVDS13_P
DIOT_LVDS14_N: R40.1 ; port DIOT_LVDS_B.DIOT_LVDS14_N
DIOT_LVDS14_P: R38.1 ; port DIOT_LVDS_B.DIOT_LVDS14_P
DIOT_LVDS15_N: R44.1 ; port DIOT_LVDS_B.DIOT_LVDS15_N
DIOT_LVDS15_P: R42.1 ; port DIOT_LVDS_B.DIOT_LVDS15_P
EEM_LVDS0_N: IC3.7(~{Q0}) IC10.2(IN0-) R15.2 ; port EEM_LVDS_A.EEM_LVDS0_N
EEM_LVDS0_P: IC3.8(Q0) IC10.1(IN0+) R13.2 ; port EEM_LVDS_A.EEM_LVDS0_P
EEM_LVDS1_N: IC10.5(IN1-) R19.2 ; port EEM_LVDS_A.EEM_LVDS1_N
EEM_LVDS1_P: IC10.4(IN1+) R17.2 ; port EEM_LVDS_A.EEM_LVDS1_P
EEM_LVDS2_N: IC10.7(IN2-) R23.2 ; port EEM_LVDS_A.EEM_LVDS2_N
EEM_LVDS2_P: IC10.6(IN2+) R21.2 ; port EEM_LVDS_A.EEM_LVDS2_P
EEM_LVDS3_N: IC10.10(IN3-) R27.2 ; port EEM_LVDS_A.EEM_LVDS3_N
EEM_LVDS3_P: IC10.9(IN3+) R25.2 ; port EEM_LVDS_A.EEM_LVDS3_P
EEM_LVDS4_N: R31.2 ; port EEM_LVDS_A.EEM_LVDS4_N
EEM_LVDS4_P: R29.2 ; port EEM_LVDS_A.EEM_LVDS4_P
EEM_LVDS5_N: R35.2 ; port EEM_LVDS_A.EEM_LVDS5_N
EEM_LVDS5_P: R33.2 ; port EEM_LVDS_A.EEM_LVDS5_P
EEM_LVDS6_N: R39.2 ; port EEM_LVDS_A.EEM_LVDS6_N
EEM_LVDS6_P: R37.2 ; port EEM_LVDS_A.EEM_LVDS6_P
EEM_LVDS7_N: R43.2 ; port EEM_LVDS_A.EEM_LVDS7_N
EEM_LVDS7_P: R41.2 ; port EEM_LVDS_A.EEM_LVDS7_P
EEM_LVDS8_N: IC2.7(~{Q0}) R16.2 ; port EEM_LVDS_B.EEM_LVDS8_N
EEM_LVDS8_P: IC2.8(Q0) R14.2 ; port EEM_LVDS_B.EEM_LVDS8_P
EEM_LVDS9_N: IC11.2(IN0-) R20.2 ; port EEM_LVDS_B.EEM_LVDS9_N
EEM_LVDS9_P: IC11.1(IN0+) R18.2 ; port EEM_LVDS_B.EEM_LVDS9_P
EEM_LVDS10_N: IC11.5(IN1-) R24.2 ; port EEM_LVDS_B.EEM_LVDS10_N
EEM_LVDS10_P: IC11.4(IN1+) R22.2 ; port EEM_LVDS_B.EEM_LVDS10_P
EEM_LVDS11_N: IC11.7(IN2-) R28.2 ; port EEM_LVDS_B.EEM_LVDS11_N
EEM_LVDS11_P: IC11.6(IN2+) R26.2 ; port EEM_LVDS_B.EEM_LVDS11_P
EEM_LVDS12_N: IC11.10(IN3-) R32.2 ; port EEM_LVDS_B.EEM_LVDS12_N
EEM_LVDS12_P: IC11.9(IN3+) R30.2 ; port EEM_LVDS_B.EEM_LVDS12_P
EEM_LVDS13_N: IC12.1(RI1-) R36.2 ; port EEM_LVDS_B.EEM_LVDS13_N
EEM_LVDS13_P: IC12.2(RI1+) R34.2 ; port EEM_LVDS_B.EEM_LVDS13_P
EEM_LVDS14_N: IC12.4(RI2-) R40.2 ; port EEM_LVDS_B.EEM_LVDS14_N
EEM_LVDS14_P: IC12.3(RI2+) R38.2 ; port EEM_LVDS_B.EEM_LVDS14_P
EEM_LVDS15_N: IC14.9(DOUT4-) R44.2 ; port EEM_LVDS_B.EEM_LVDS15_N
EEM_LVDS15_P: IC14.10(DOUT4+) R42.2 ; port EEM_LVDS_B.EEM_LVDS15_P
EQ: IC10.11(EQ2) IC10.12(EQ3) IC10.39(EQ1) IC10.40(EQ0) IC11.11(EQ2) IC11.12(EQ3) IC11.39(EQ1) IC11.40(EQ0) R87.1 R89.2
FRONT_CLK_PM1_N: IC3.3(~{IN}) ; port HDMI_LVDS_A.FRONT_CLK_PM1_N
FRONT_CLK_PM1_P: IC3.2(IN) ; port HDMI_LVDS_A.FRONT_CLK_PM1_P
FRONT_CLK_PM2_N: IC2.3(~{IN}) ; port HDMI_LVDS_A.FRONT_CLK_PM2_N
FRONT_CLK_PM2_P: IC2.2(IN) ; port HDMI_LVDS_A.FRONT_CLK_PM2_P
FRONT_LVDS0_N: IC10.28(OUT0-) ; port HDMI_LVDS_A.HDMI_LVDS0_N
FRONT_LVDS0_P: IC10.29(OUT0+) ; port HDMI_LVDS_A.HDMI_LVDS0_P
FRONT_LVDS1_N: IC10.26(OUT1-) ; port HDMI_LVDS_A.HDMI_LVDS1_N
FRONT_LVDS1_P: IC10.27(OUT1+) ; port HDMI_LVDS_A.HDMI_LVDS1_P
FRONT_LVDS2_N: IC10.23(OUT2-) ; port HDMI_LVDS_A.HDMI_LVDS2_N
FRONT_LVDS2_P: IC10.24(OUT2+) ; port HDMI_LVDS_A.HDMI_LVDS2_P
FRONT_LVDS3_N: IC10.21(OUT3-) ; port HDMI_LVDS_A.HDMI_LVDS3_N
FRONT_LVDS3_P: IC10.22(OUT3+) ; port HDMI_LVDS_A.HDMI_LVDS3_P
FRONT_LVDS4_N: IC11.28(OUT0-) ; port HDMI_LVDS_A.HDMI_LVDS4_N
FRONT_LVDS4_P: IC11.29(OUT0+) ; port HDMI_LVDS_A.HDMI_LVDS4_P
FRONT_LVDS5_N: IC11.26(OUT1-) ; port HDMI_LVDS_A.HDMI_LVDS5_N
FRONT_LVDS5_P: IC11.27(OUT1+) ; port HDMI_LVDS_A.HDMI_LVDS5_P
FRONT_LVDS6_N: IC11.23(OUT2-) ; port HDMI_LVDS_A.HDMI_LVDS6_N
FRONT_LVDS6_P: IC11.24(OUT2+) ; port HDMI_LVDS_A.HDMI_LVDS6_P
FRONT_LVDS7_N: IC11.21(OUT3-) ; port HDMI_LVDS_A.HDMI_LVDS7_N
FRONT_LVDS7_P: IC11.22(OUT3+) ; port HDMI_LVDS_A.HDMI_LVDS7_P
FRONT_TTL_0: IC4.2(DIN1) ; port HDMI_TTL.FRONT_TTL_0
FRONT_TTL_1: IC4.3(DIN2) ; port HDMI_TTL.FRONT_TTL_1
FRONT_TTL_2: IC4.6(DIN3) R92.2 ; port HDMI_TTL.FRONT_TTL_2
FRONT_TTL_4: IC14.2(DIN1) ; port HDMI_TTL.FRONT_TTL_4
FRONT_TTL_5: IC14.3(DIN2) ; port HDMI_TTL.FRONT_TTL_5
FRONT_TTL_6: IC14.6(DIN3) R93.2 ; port HDMI_TTL.FRONT_TTL_6
FRONT_TTL_8: port REDRIVER_TTL.FRONT_TTL_8, port HDMI_TTL.FRONT_TTL_8
FRONT_TTL_9: port REDRIVER_TTL.FRONT_TTL_9, port HDMI_TTL.FRONT_TTL_9
FRONT_TTL_10: port REDRIVER_TTL.FRONT_TTL_10, port HDMI_TTL.FRONT_TTL_10
FRONT_TTL_11: port REDRIVER_TTL.FRONT_TTL_11, port HDMI_TTL.FRONT_TTL_11
FRONT_TTL_12: port REDRIVER_TTL.FRONT_TTL_12, port HDMI_TTL.FRONT_TTL_12
FRONT_TTL_13: port REDRIVER_TTL.FRONT_TTL_13, port HDMI_TTL.FRONT_TTL_13
LHC_CLK_N: IC3.5(~{Q1}) IC12.5(RI3-)
LHC_CLK_P: IC3.6(Q1) IC12.6(RI3+)
MOSI_N: IC18.10(nQ)
MOSI_P: IC18.11(Q)
nLOS: IC10.13(~{LOS3}) IC10.14(~{LOS0}) IC10.36(~{LOS2}) IC10.37(~{LOS1}) IC11.13(~{LOS3}) IC11.14(~{LOS0}) IC11.36(~{LOS2}) IC11.37(~{LOS1}) R82.1
nPWDN: IC10.32(~{PWDN3}) IC10.33(~{PWDN2}) IC10.34(~{PWDN1}) IC10.35(~{PWDN0}) IC10.38(~{PWDN}) IC11.32(~{PWDN3}) IC11.33(~{PWDN2}) IC11.34(~{PWDN1}) IC11.35(~{PWDN0}) IC11.38(~{PWDN}) ; port REDRIVER_TTL.nPWDN
PE: IC10.18(PE3) IC10.19(PE2) IC10.20(PE1) IC10.31(PE0) IC11.18(PE3) IC11.19(PE2) IC11.20(PE1) IC11.31(PE0) R86.1 R88.2
PM1_CLK_N: IC4.13(DOUT2-) IC16.2(nPCLK0)
PM1_CLK_P: IC4.14(DOUT2+) IC16.1(PCLK0)
PM1_MOSI_N: IC4.12(DOUT3-) IC18.2(nPCLK0)
PM1_MOSI_P: IC4.11(DOUT3+) IC18.1(PCLK0)
PM1_SEL_N: IC4.16(DOUT1-) IC13.2(nPCLK0)
PM1_SEL_P: IC4.15(DOUT1+) IC13.1(PCLK0)
PM2_CLK_N: IC14.13(DOUT2-) IC16.4(nPCLK1)
PM2_CLK_P: IC14.14(DOUT2+) IC16.3(PCLK1)
PM2_MOSI_N: IC14.12(DOUT3-) IC18.4(nPCLK1)
PM2_MOSI_P: IC14.11(DOUT3+) IC18.3(PCLK1)
PM2_SEL_N: IC13.4(nPCLK1) IC14.16(DOUT1-)
PM2_SEL_P: IC13.3(PCLK1) IC14.15(DOUT1+)
SEL_N: IC13.10(nQ)
SEL_P: IC13.11(Q)
NetC67_1: R94.2 ; port LOW_CLK
NetIC4_1: IC4.1(EN) R95.1
NetIC4_8: IC4.8(~{EN}) R96.1
NetIC12_7: IC12.7(RI4+) R81.1
NetIC12_8: IC12.8(RI4-) R83.2
NetIC12_9: IC12.9(~{EN}) R85.2
NetIC12_10: IC12.10(RO4) R110.1
NetIC12_11: IC12.11(RO3) R94.1 R127.1
NetIC12_14: IC12.14(RO2) R93.1
NetIC12_15: IC12.15(RO1) R92.1
NetIC12_16: IC12.16(EN) R84.2
NetIC14_1: IC14.1(EN) R90.1
NetIC14_8: IC14.8(~{EN}) R91.1
NetJ4_1: R127.2 ; port LHC_CLK

Not connected (* = marked no-connect by the designer): IC2 5(~{Q1})* 6(Q1)*; IC4 9(DOUT4-)* 10(DOUT4+)*; IC10 17(NC)*; IC11 17(NC)*; IC13 5(RSV)* 7(NC)* 16(NC)*; IC16 5(RSV)* 7(NC)* 16(NC)*; IC18 5(RSV)* 7(NC)* 16(NC)*; R110 2*

### Layout directives
differential pair; net class LVDS; differential pair class LVDS_DIFF: FRONT_CLK_PM1_N, FRONT_CLK_PM1_P, FRONT_CLK_PM2_N, FRONT_CLK_PM2_P, FRONT_LVDS0_N, FRONT_LVDS0_P, FRONT_LVDS1_N, FRONT_LVDS1_P, FRONT_LVDS2_N, FRONT_LVDS2_P, FRONT_LVDS3_N, FRONT_LVDS3_P, FRONT_LVDS4_N, FRONT_LVDS4_P, FRONT_LVDS5_N, FRONT_LVDS5_P, FRONT_LVDS6_N, FRONT_LVDS6_P, FRONT_LVDS7_N, FRONT_LVDS7_P, LHC_CLK_N, LHC_CLK_P

### Notes on the sheet
- (near IC10) From LVDS[1..4]
- (near IC10) PM 1 Buffer
- (near IC10) To TCM
- (near IC11) From LVDS[9..12]
- (near IC11) PM 2 Buffer
- (near IC11) To TCM
- LVDS0_P PM->TCM
- LVDS0_N PM->TCM
- LVDS1_P TCM->PM
- LVDS1_N PM->TCM
- LVDS2_P PM->TCM
- LVDS2_N PM->TCM
- LVDS3_P PM->TCM
- LVDS3_N PM->TCM
- LHC 40MHz CLK LVDS_P TCM->PM
- LHC 40MHz CLK LVDS_N TCM->PM
- DIOT Active only with jumpers populated
- TCM SPI_SEL
- TCM SPI_CLK
- TCM SPI_COPI (MOSI)
- TCM SPI_CIPO (MISO)
- PM SPI_SEL
- PM SPI_CLK
- PM SPI_COPI (MOSI)
- PM SPI_CIPO (MISO)
- TCM ACTIV
- TCM SELECTED
- PM ACTIVE
- PM SELECTED
- CARD READY
- ERROR
- (in symbol DS90LV047ATM/NOPB) D1; D2; D3; D4

### Library data of the parts
IC2 IC3 = SY89835UMG: 2.5V, 2GHz (3.2 Gbps) Ultra-Precision, Differential 1:2 LVDS Fanout Buffer With Internal Termination and Fail Safe Input; Manufacturer: MICREL; PressFit: No; Bonding: No; Part Number: SY89835UMG; Component Kind: Standard; Component Type: Standard; Device: SY89835UMG; PackageDescription: SON, 0.50mm Pitch; 8 Pin, 2.00mm W X 2.00mm L X 0.90mm H body (w/Thermal Tab 0.70 X 1.30mm), IPC Medium Density; Part Description: 2.5V, 2GHz (3.2 Gbps) Ultra-Precision, Differential 1:2 LVDS Fanout Buffer with Internal Termination and Fail Safe Input; Manufacturer Part Number: SY89835UMG; Pin Count: 9; Case: SON8; Mounted: Yes; Socket: No; SMD: Yes; Sense: No; ComponentHeight: 0.9mm; Author: CERN DEM MR; HelpURL: \\cern.ch\dfs\Applications\Altium\Datasheets\SY89835UMG.pdf; CreateDate: 22.04.2016; LatestRevisionDate: 22.04.2016
IC4 IC14 = DS90LV047ATM/NOPB: 3V LVDS Quad CMOS Differential Line Driver; Manufacturer: TEXAS INSTRUMENTS; PressFit: No; Bonding: No; Part Number: DS90LV047ATM/NOPB; Component Kind: Standard; Component Type: Standard; Device: DS90LV047ATM/NOPB; PackageDescription: SOIC 16, Pitch 1.27mm - Body 4x10mm, IPC Medium Density; Part Description: 3V LVDS Quad CMOS Differential Line Driver; Manufacturer Part Number: DS90LV047ATM; Pin Count: 16; Case: SOIC16; Mounted: Yes; Socket: No; SMD: Yes; Sense: No; ComponentHeight: 1.75mm; Author: CERN DEM JLC; HelpURL: \\cern.ch\dfs\Applications\Altium\Datasheets\DS90LV047ATM-NOPB.pdf; CreateDate: 02.07.2014; LatestRevisionDate: 01.06.2022
IC10 IC11 = DS25BR440TSQ/NOPB: 3.125-Gbps Quad LVDS Buffer with Transmit Pre-Emphasis and Receive Equalization; Manufacturer: TEXAS INSTRUMENTS; PressFit: No; Bonding: No; Part Number: DS25BR440TSQ/NOPB; Component Kind: Standard; Component Type: Standard; Device: DS25BR440TSQ/NOPB; PackageDescription: QFN, 0.50mm Pitch, Square; 40 Pin, 6.00mm L X 6.00mm W X 0.80mm H Body (w/Thermal Tab 4.80 x 4.80mm), IPC Medium Density; Part Description: 3.125-Gbps Quad LVDS Buffer with Transmit Pre-Emphasis and Receive Equalization; Manufacturer Part Number: DS25BR440TSQ; Pin Count: 41; Case: QFN40; Mounted: Yes; Socket: No; SMD: Yes; Sense: No; ComponentHeight: 0.8mm; Author: CERN DEM HF; HelpURL: \\cern.ch\dfs\Applications\Altium\Datasheets\DS25BR440TSQ-NOPB.pdf; CreateDate: 05.11.2021; LatestRevisionDate: 01.06.2022
IC12 = DS90LV048ATM/NOPB: 3V LVDS Quad CMOS Differential Line Receiver; Manufacturer: TEXAS INSTRUMENTS; PressFit: No; Bonding: No; Part Number: DS90LV048ATM/NOPB; Component Kind: Standard; Component Type: Standard; Device: DS90LV048ATM/NOPB; PackageDescription: SOIC 16, Pitch 1.27mm - Body 4x10mm, IPC Medium Density; Part Description: 3V LVDS Quad CMOS Differential Line Receiver; Manufacturer Part Number: DS90LV048ATM; Pin Count: 16; Case: SOIC16; Mounted: Yes; Socket: No; SMD: Yes; Sense: No; ComponentHeight: 1.75mm; Author: CERN DEM JLC; HelpURL: \\cern.ch\dfs\Applications\Altium\Datasheets\DS90LV048ATM-NOPB.pdf; CreateDate: 10.03.2014; LatestRevisionDate: 01.06.2022
IC13 IC16 IC18 = 854S01AKILF: 2:1 Differential-to-LVDS Multiplexer; Manufacturer: INTEGRATED DEVICE TECHNOLOGY (IDT); PressFit: No; Bonding: No; Part Number: 854S01AKILF; Component Kind: Standard; Component Type: Standard; Device: 854S01AKILF; PackageDescription: QFN, 0.50mm Pitch, Square; 16 Pin, 3.00mm L X 3.00mm W X 1.00mm H body (w/Thermal Tab 1.80 X 1.80mm), IPC Medium Density; Part Description: 2:1 Differential-to-LVDS Multiplexer; Manufacturer Part Number: 854S01AKILF; Pin Count: 17; Case: QFN16; Mounted: Yes; Socket: No; SMD: Yes; Sense: No; ComponentHeight: 1mm; Author: CERN DEM JLC; HelpURL: \\cern.ch\dfs\Applications\Altium\Datasheets\854S01AKILF.pdf; CreateDate: 23.02.2017; LatestRevisionDate: 23.02.2017
R13-R44 R92-R94 R110 R127 = R0402_0R_JUMPER: Resistor; Part Description: 1A (0.05R Max DC Resistance) Zero Ohm Jumper; Manufacturer: GENERIC; Manufacturer1 Part Number: 232270591001L; PressFit: No; Part Number: R0402_0R_JUMPER; Component Kind: Standard; Component Type: Standard; Pin Count: 2; Value: 0; Status: Not Recommended; Manufacturer Part Number: R0402_0R_JUMPER; Case: 0402; Mounted: Yes; Sense: No; Socket: No; SMD: Yes; Manufacturer1 Example: YAGEO PHYCOMP; Manufacturer1 ComponentHeight: 0.4mm; HelpURL: \\cern.ch\dfs\Applications\Altium\Datasheets\R0402_Phycomp_RC0402.pdf; Author: CERN DEM JLC; CreateDate: 03.12.2007; LatestRevisionDate: 17.10.2012
R81-R91 R95 R96 = R0603_10K_1%_0.1W_100PPM: Resistor - 1%; Part Description: General Purpose Thick Film Chip Resistor; Manufacturer: GENERIC; Manufacturer1 Part Number: NRC06F1002TRF; Power: 0.1W; TC: ±100ppm/°C; PressFit: No; Part Number: R0603_10K_1%_0.1W_100PPM; Component Kind: Standard; Component Type: Standard; Pin Count: 2; Value: 10k; Status: Preferred; Manufacturer Part Number: R0603_10K_1%_0.1W_100PPM; Case: 0603; Mounted: Yes; Sense: No; Socket: No; SMD: Yes; Manufacturer1 Example: NIC COMPONENT; Manufacturer1 ComponentHeight: 0.55mm; HelpURL: \\cern.ch\dfs\Applications\Altium\Datasheets\R0603_NIC_NRC.pdf; Author: CERN DEM JLC; CreateDate: 03.12.2007; LatestRevisionDate: 13.03.2008

## Sheet DIOT_CONN.SchDoc
size A3; SheetNumber: 2; SheetTotal: 7
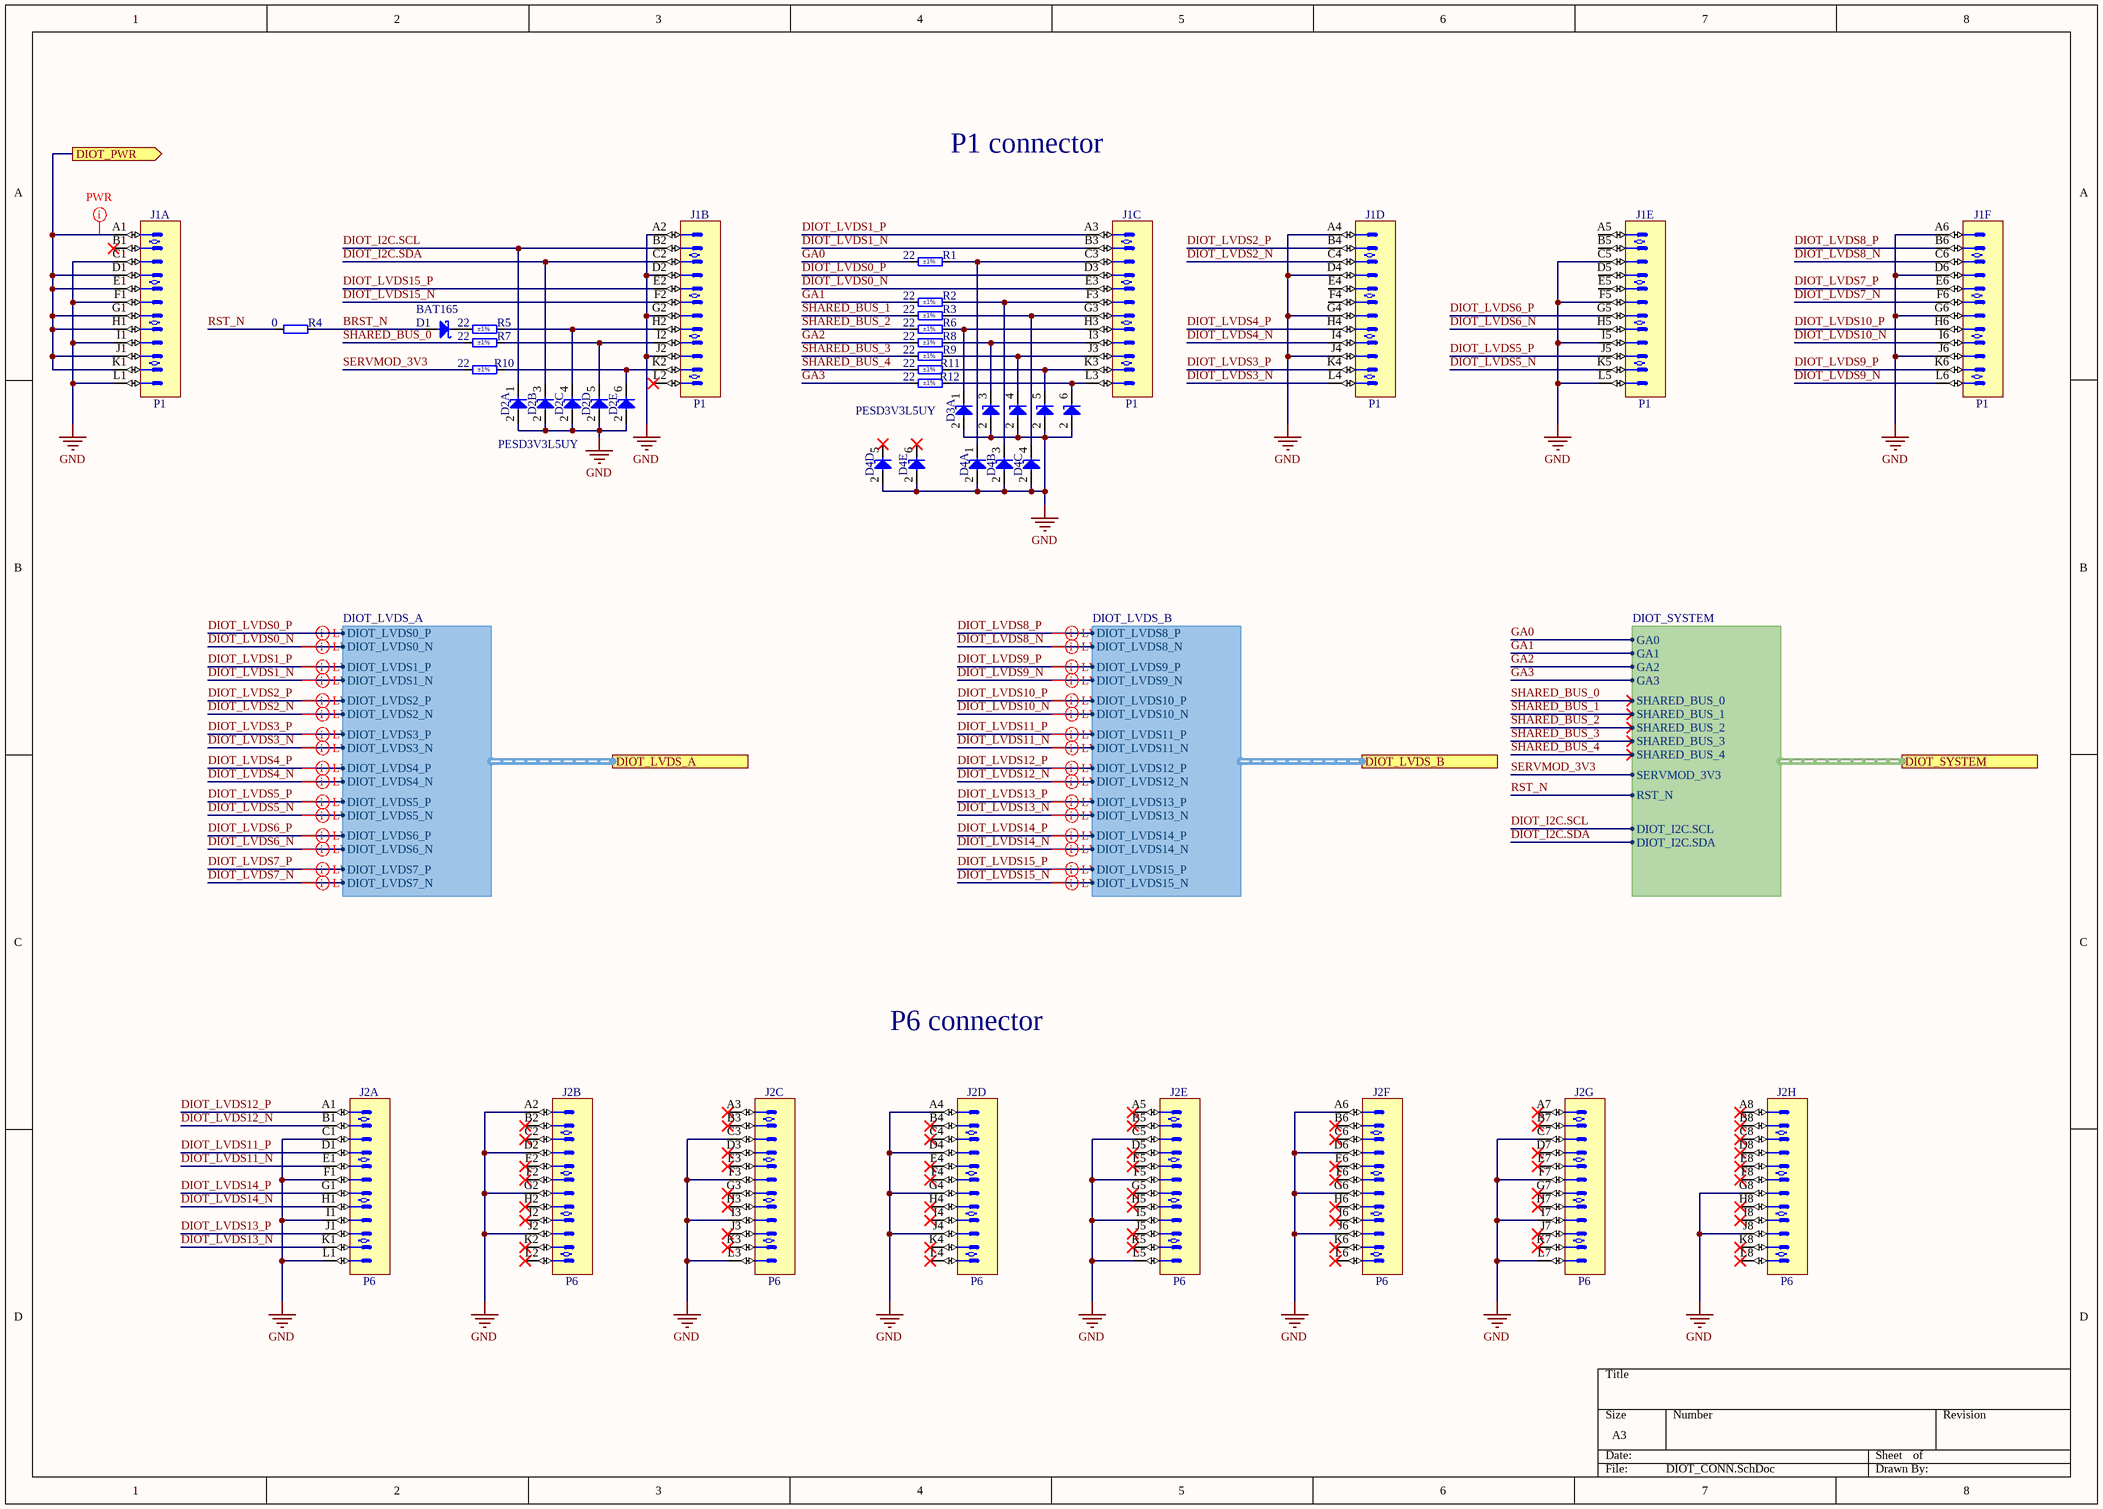
[diagram p3: DIOT_CONN.SchDoc]

### Parts
D1  BAT165  [SOD2512X110N]
D2  PESD3V3L5UY  [SOT65P210X110-6N]  (parts A,B,C,D,E of 5)
D3  PESD3V3L5UY  [SOT65P210X110-6N]  (parts A,B,C,D,E of 5)
D4  PESD3V3L5UY  [SOT65P210X110-6N]  (value not drawn)  (parts A,B,C,D,E of 5)
J1  P1  [AMPHENOL_10052825-101LF]  (parts A,B,C,D,E,F of 6)
J2  P6  [AMPHENOL_10052838-101LF]  (parts A,B,C,D,E,F,G,H of 8)
R1  22  Tolerance: ±1%  [RESC1005X40N]
R2  22  Tolerance: ±1%  [RESC1005X40N]
R3  22  Tolerance: ±1%  [RESC1005X40N]
R4  0  [RESC1005X40N]
R5  22  Tolerance: ±1%  [RESC1005X40N]
R6  22  Tolerance: ±1%  [RESC1005X40N]
R7  22  Tolerance: ±1%  [RESC1005X40N]
R8  22  Tolerance: ±1%  [RESC1005X40N]
R9  22  Tolerance: ±1%  [RESC1005X40N]
R10  22  Tolerance: ±1%  [RESC1005X40N]
R11  22  Tolerance: ±1%  [RESC1005X40N]
R12  22  Tolerance: ±1%  [RESC1005X40N]

### Ports
DIOT_LVDS_A (harness DIOT_LVDS_A, see BLOCK_DIAGRAM[6A], REDRIVERS[1A]), DIOT_LVDS_B (harness DIOT_LVDS_B, see BLOCK_DIAGRAM[6A], REDRIVERS[1B]), DIOT_PWR (out, see BLOCK_DIAGRAM[6B], PSU[1A], PSU[1D]), DIOT_SYSTEM (harness DIOT_SYSTEM, see BLOCK_DIAGRAM[7B], SYSTEM[1A])

### Harnesses
DIOT_SYSTEM: GA0, GA1, GA2, GA3, SHARED_BUS_0, SHARED_BUS_1, SHARED_BUS_2, SHARED_BUS_3, SHARED_BUS_4, SERVMOD_3V3, RST_N, DIOT_I2C.SCL, DIOT_I2C.SDA
DIOT_LVDS_A: DIOT_LVDS0_P, DIOT_LVDS0_N, DIOT_LVDS1_P, DIOT_LVDS1_N, DIOT_LVDS2_P, DIOT_LVDS2_N, DIOT_LVDS3_P, DIOT_LVDS3_N, DIOT_LVDS4_P, DIOT_LVDS4_N, DIOT_LVDS5_P, DIOT_LVDS5_N, DIOT_LVDS6_P, DIOT_LVDS6_N, DIOT_LVDS7_P, DIOT_LVDS7_N
DIOT_LVDS_B: DIOT_LVDS8_P, DIOT_LVDS8_N, DIOT_LVDS9_P, DIOT_LVDS9_N, DIOT_LVDS10_P, DIOT_LVDS10_N, DIOT_LVDS11_P, DIOT_LVDS11_N, DIOT_LVDS12_P, DIOT_LVDS12_N, DIOT_LVDS13_P, DIOT_LVDS13_N, DIOT_LVDS14_P, DIOT_LVDS14_N, DIOT_LVDS15_P, DIOT_LVDS15_N

### Nets
GND: D2.2(A) D3.2(A) D4.2(A) J1.A2 J1.A4 J1.A6 J1.C1 J1.C5 J1.D2 J1.D4 J1.D6 J1.F1 J1.F5 J1.G2 J1.G4 J1.G6 J1.I1 J1.I5 J1.J2 J1.J4 J1.J6 J1.L1 J1.L5 J2.A2 J2.A4 J2.A6 J2.C1 J2.C3 J2.C5 J2.C7 J2.D2 J2.D4 J2.D6 J2.F1 J2.F3 J2.F5 J2.F7 J2.G2 J2.G4 J2.G6 J2.G8 J2.I1 J2.I3 J2.I5 J2.I7 J2.J2 J2.J4 J2.J6 J2.J8 J2.L1 J2.L3 J2.L5 J2.L7
BRST_N: D1.2(A) R4.2
DIOT_I2C.SCL: D2.1(C) J1.B2 ; port DIOT_SYSTEM.DIOT_I2C.SCL
DIOT_I2C.SDA: D2.3(C) J1.C2 ; port DIOT_SYSTEM.DIOT_I2C.SDA
DIOT_LVDS0_N: J1.E3 ; port DIOT_LVDS_A.DIOT_LVDS0_N
DIOT_LVDS0_P: J1.D3 ; port DIOT_LVDS_A.DIOT_LVDS0_P
DIOT_LVDS1_N: J1.B3 ; port DIOT_LVDS_A.DIOT_LVDS1_N
DIOT_LVDS1_P: J1.A3 ; port DIOT_LVDS_A.DIOT_LVDS1_P
DIOT_LVDS2_N: J1.C4 ; port DIOT_LVDS_A.DIOT_LVDS2_N
DIOT_LVDS2_P: J1.B4 ; port DIOT_LVDS_A.DIOT_LVDS2_P
DIOT_LVDS3_N: J1.L4 ; port DIOT_LVDS_A.DIOT_LVDS3_N
DIOT_LVDS3_P: J1.K4 ; port DIOT_LVDS_A.DIOT_LVDS3_P
DIOT_LVDS4_N: J1.I4 ; port DIOT_LVDS_A.DIOT_LVDS4_N
DIOT_LVDS4_P: J1.H4 ; port DIOT_LVDS_A.DIOT_LVDS4_P
DIOT_LVDS5_N: J1.K5 ; port DIOT_LVDS_A.DIOT_LVDS5_N
DIOT_LVDS5_P: J1.J5 ; port DIOT_LVDS_A.DIOT_LVDS5_P
DIOT_LVDS6_N: J1.H5 ; port DIOT_LVDS_A.DIOT_LVDS6_N
DIOT_LVDS6_P: J1.G5 ; port DIOT_LVDS_A.DIOT_LVDS6_P
DIOT_LVDS7_N: J1.F6 ; port DIOT_LVDS_A.DIOT_LVDS7_N
DIOT_LVDS7_P: J1.E6 ; port DIOT_LVDS_A.DIOT_LVDS7_P
DIOT_LVDS8_N: J1.C6 ; port DIOT_LVDS_B.DIOT_LVDS8_N
DIOT_LVDS8_P: J1.B6 ; port DIOT_LVDS_B.DIOT_LVDS8_P
DIOT_LVDS9_N: J1.L6 ; port DIOT_LVDS_B.DIOT_LVDS9_N
DIOT_LVDS9_P: J1.K6 ; port DIOT_LVDS_B.DIOT_LVDS9_P
DIOT_LVDS10_N: J1.I6 ; port DIOT_LVDS_B.DIOT_LVDS10_N
DIOT_LVDS10_P: J1.H6 ; port DIOT_LVDS_B.DIOT_LVDS10_P
DIOT_LVDS11_N: J2.E1 ; port DIOT_LVDS_B.DIOT_LVDS11_N
DIOT_LVDS11_P: J2.D1 ; port DIOT_LVDS_B.DIOT_LVDS11_P
DIOT_LVDS12_N: J2.B1 ; port DIOT_LVDS_B.DIOT_LVDS12_N
DIOT_LVDS12_P: J2.A1 ; port DIOT_LVDS_B.DIOT_LVDS12_P
DIOT_LVDS13_N: J2.K1 ; port DIOT_LVDS_B.DIOT_LVDS13_N
DIOT_LVDS13_P: J2.J1 ; port DIOT_LVDS_B.DIOT_LVDS13_P
DIOT_LVDS14_N: J2.H1 ; port DIOT_LVDS_B.DIOT_LVDS14_N
DIOT_LVDS14_P: J2.G1 ; port DIOT_LVDS_B.DIOT_LVDS14_P
DIOT_LVDS15_N: J1.F2 ; port DIOT_LVDS_B.DIOT_LVDS15_N
DIOT_LVDS15_P: J1.E2 ; port DIOT_LVDS_B.DIOT_LVDS15_P
GA0: R1.1 ; port DIOT_SYSTEM.GA0
GA1: R2.1 ; port DIOT_SYSTEM.GA1
GA2: R8.1 ; port DIOT_SYSTEM.GA2
GA3: R12.1 ; port DIOT_SYSTEM.GA3
RST_N: R4.1 ; port DIOT_SYSTEM.RST_N
SERVMOD_3V3: R10.1 ; port DIOT_SYSTEM.SERVMOD_3V3
SHARED_BUS_0: R7.1 ; port DIOT_SYSTEM.SHARED_BUS_0
SHARED_BUS_1: R3.1 ; port DIOT_SYSTEM.SHARED_BUS_1
SHARED_BUS_2: R6.1 ; port DIOT_SYSTEM.SHARED_BUS_2
SHARED_BUS_3: R9.1 ; port DIOT_SYSTEM.SHARED_BUS_3
SHARED_BUS_4: R11.1 ; port DIOT_SYSTEM.SHARED_BUS_4
NetC1_2: J1.A1 J1.D1 J1.E1 J1.G1 J1.H1 J1.J1 J1.K1 ; port DIOT_PWR
NetD1_1: D1.1(C) R5.1
NetD2_4: D2.4(C) J1.H2 R5.2
NetD2_5: D2.5(C) J1.I2 R7.2
NetD2_6: D2.6(C) J1.K2 R10.2
NetD3_1: D3.1(C) J1.H3 R6.2
NetD3_3: D3.3(C) J1.I3 R8.2
NetD3_4: D3.4(C) J1.J3 R9.2
NetD3_5: D3.5(C) J1.K3 R11.2
NetD3_6: D3.6(C) J1.L3 R12.2
NetD4_1: D4.1(C) J1.C3 R1.2
NetD4_3: D4.3(C) J1.F3 R2.2
NetD4_4: D4.4(C) J1.G3 R3.2

Not connected (* = marked no-connect by the designer): D4 5(C)* 6(C)*; J1 A5 B1* B5 D5 E4 E5 F4 L2*; J2 A3* A5* A7* A8* B2* B3* B4* B5* B6* B7* B8* C2* C4* C6* C8* D3* D5* D7* D8* E2* E3* E4* E5* E6* E7* E8* F2* F4* F6* F8* G3* G5* G7* H2* H3* H4* H5* H6* H7* H8* I2* I4* I6* I8* J3* J5* J7* K2* K3* K4* K5* K6* K7* K8* L2* L4* L6* L8*

### Layout directives
net class PWR: NetC1_2
differential pair; net class LVDS; differential pair class LVDS_DIFF: DIOT_LVDS0_N, DIOT_LVDS0_P, DIOT_LVDS1_N, DIOT_LVDS1_P, DIOT_LVDS2_N, DIOT_LVDS2_P, DIOT_LVDS3_N, DIOT_LVDS3_P, DIOT_LVDS4_N, DIOT_LVDS4_P, DIOT_LVDS5_N, DIOT_LVDS5_P, DIOT_LVDS6_N, DIOT_LVDS6_P, DIOT_LVDS7_N, DIOT_LVDS7_P, DIOT_LVDS8_N, DIOT_LVDS8_P, DIOT_LVDS9_N, DIOT_LVDS9_P, DIOT_LVDS10_N, DIOT_LVDS10_P, DIOT_LVDS11_N, DIOT_LVDS11_P, DIOT_LVDS12_N, DIOT_LVDS12_P, DIOT_LVDS13_N, DIOT_LVDS13_P, DIOT_LVDS14_N, DIOT_LVDS14_P, DIOT_LVDS15_N, DIOT_LVDS15_P

### Notes on the sheet
- P1 connector
- P6 connector

### Library data of the parts
D1 = BAT165: Schottky Diode; Part Description: Medium Power AF Schottky Diode; Manufacturer: INFINEON; Voltage: 40V; Power: 750mA; PressFit: No; Bonding: No; Part Number: BAT165; Component Kind: Standard; Component Type: Standard; Device: BAT165; PackageDescription: Small Outline Diode (SOD-323), 1.70mm W X 1.25mm L X 1.10mm H body,  IPC Medium Density; Manufacturer Part Number: BAT165; Pin Count: 2; Case: SOD-323; Mounted: Yes; Socket: No; SMD: Yes; Sense: No; ComponentHeight: 1.1mm; HelpURL: \\cern.ch\dfs\Applications\Altium\Datasheets\BAT165.pdf; Author: CERN DEM JLC; CreateDate: 12.11.2014; LatestRevisionDate: 12.11.2014
D2-D4 = PESD3V3L5UY: Fivefold ESD Protection Diode Arrays; Part Description: Fivefold ESD Protection Diode Arrays (30kV); Manufacturer: NEXPERIA; Voltage: 3.3V; Power: 200W; PressFit: No; Bonding: No; Part Number: PESD3V3L5UY; Component Kind: Standard; Component Type: Standard; Device: PESD3V3L5UY; PackageDescription: SOT363, SC-88, 0.65mm Pitch; 6 Pin, 1.25mm W X 2.00mm L X 1.10mm H body, IPC Medium Density; Manufacturer Part Number: PESD3V3L5UY; Pin Count: 6; Case: SOT363; Mounted: Yes; Socket: No; SMD: Yes; Sense: No; ComponentHeight: 1.1mm; HelpURL: \\cern.ch\dfs\Applications\Altium\Datasheets\PESD3V3L5UY.pdf; Author: CERN DEM WB; CreateDate: 05.07.2021; LatestRevisionDate: 05.07.2021
J1 = AMPHENOL_10052825-101LF: 72 Contacts Header, 6 Columns, 4 Pairs per Column; Part Description: 72 Contacts, 2mm Pitch, 6 Columns, 4 Pairs per Column, 4 Walls, Right Angle Header; Part Number: AMPHENOL_10052825-101LF; Component Kind: Standard; Component Type: Standard; Pin Count: 72; Family: AirMax VS; Mounted: Yes; Socket: No; SMD: No; PressFit: Yes; Sense: No; Status: None; Manufacturer: AMPHENOL; Manufacturer Part Number: 10052825-101LF; ComponentHeight: 15.35mm; HelpURL: \\cern.ch\dfs\Applications\Altium\Datasheets\AMPHENOL_10052825-101LF.pdf; ComponentLink1URL: \\cern.ch\dfs\Applications\Altium\Datasheets\AMPHENOL_10052825-101LF_Application.pdf; ComponentLink1Description: Application; Author: CERN DEM MR; CreateDate: 19/02/2018; LatestRevisionDate: 19/02/2018; Classname: Overlapping
J2 = AMPHENOL_10052838-101LF: 96 Contacts Header, 8 Columns, 4 Pairs per Column; Part Description: 96 Contacts, 2mm Pitch, 8 Columns, 4 Pairs per Column, 4 Walls, Right Angle Header; Part Number: AMPHENOL_10052838-101LF; Component Kind: Standard; Component Type: Standard; Pin Count: 96; Family: AirMax VS; Mounted: Yes; Socket: No; SMD: No; PressFit: Yes; Sense: No; Status: None; Manufacturer: AMPHENOL; Manufacturer Part Number: 10052838-101LF; ComponentHeight: 15.35mm; HelpURL: \\cern.ch\dfs\Applications\Altium\Datasheets\AMPHENOL_10052838-101LF.pdf; ComponentLink1URL: \\cern.ch\dfs\Applications\Altium\Datasheets\AMPHENOL_10052838-101LF_Application.pdf; ComponentLink1Description: Application; Author: CERN DEM MR; CreateDate: 19.02.2018; LatestRevisionDate: 19.02.2018
R1-R3 R5-R12 = R0402_22R_1%_0.0625W_100PPM: Resistor - 1%; Part Description: General Purpose Thick Film Chip Resistor; Manufacturer: GENERIC; Manufacturer1 Part Number: 232270672209L; TC: ±100ppm/°C; PressFit: No; Part Number: R0402_22R_1%_0.0625W_100PPM; Component Kind: Standard; Component Type: Standard; Pin Count: 2; Value: 22; Status: Not Recommended; Power: 0.0625W; Manufacturer Part Number: R0402_22R_1%_0.0625W_100PPM; Case: 0402; Mounted: Yes; Sense: No; Socket: No; SMD: Yes; Manufacturer1 Example: YAGEO PHYCOMP; Manufacturer1 ComponentHeight: 0.4mm; HelpURL: \\cern.ch\dfs\Applications\Altium\Datasheets\R0402_Phycomp_RC0402.pdf; Author: CERN DEM JLC; CreateDate: 03.12.2007; LatestRevisionDate: 17.10.2012
R4 = R0402_0R_JUMPER: as R13 on sheet REDRIVERS; Part Number: R0402_0R_JUMPER; Component Kind: Standard; Component Type: Standard; Pin Count: 2; Value: 0; Status: Not Recommended; Manufacturer Part Number: R0402_0R_JUMPER; Case: 0402; Mounted: Yes; Sense: No; Socket: No; SMD: Yes; Manufacturer1 Example: YAGEO PHYCOMP; Manufacturer1 ComponentHeight: 0.4mm; HelpURL: \\cern.ch\dfs\Applications\Altium\Datasheets\R0402_Phycomp_RC0402.pdf; Author: CERN DEM JLC; CreateDate: 03.12.2007; LatestRevisionDate: 17.10.2012

## Sheet EEM_CONN.SchDoc
size A3; SheetNumber: 5; SheetTotal: 7
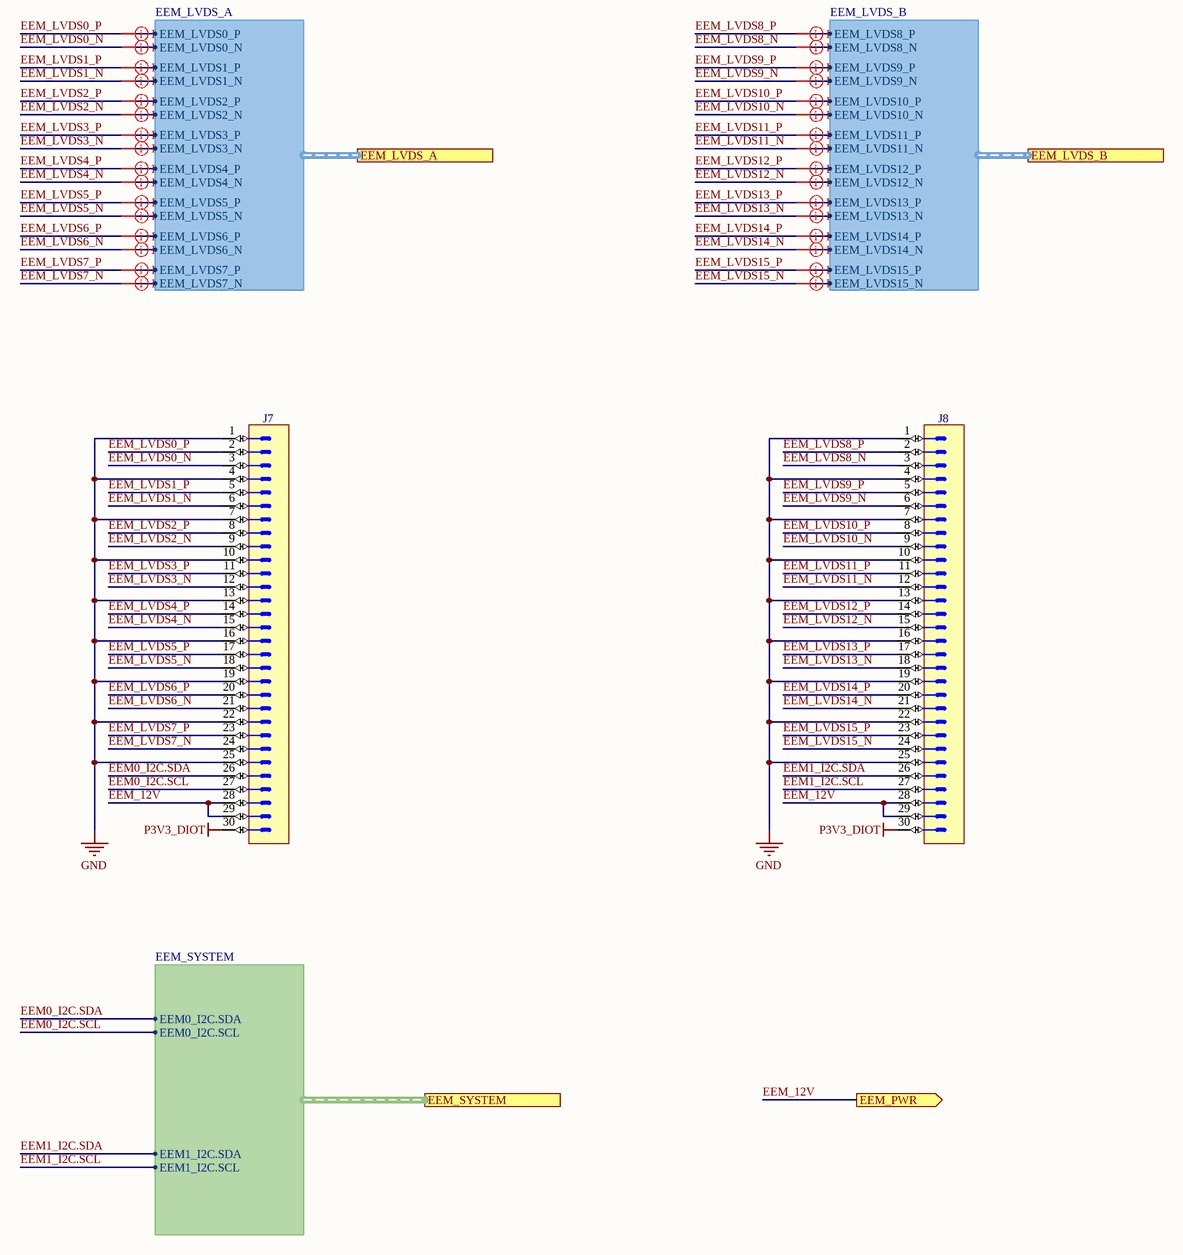
[diagram p4: EEM_CONN.SchDoc]

### Parts
J7  (no value)  [3M_N2530-6002RB]
J8  (no value)  [3M_N2530-6002RB]

### Ports
EEM_LVDS_A (harness EEM_LVDS_A, see BLOCK_DIAGRAM[6C], REDRIVERS[1C]), EEM_LVDS_B (harness EEM_LVDS_B, see BLOCK_DIAGRAM[6C], REDRIVERS[1D]), EEM_PWR (out, see BLOCK_DIAGRAM[6B], PSU[1A]), EEM_SYSTEM (harness EEM_SYSTEM, see BLOCK_DIAGRAM[7B], SYSTEM[1B])

### Harnesses
EEM_SYSTEM: EEM0_I2C.SDA, EEM0_I2C.SCL, EEM1_I2C.SDA, EEM1_I2C.SCL
EEM_LVDS_A: EEM_LVDS0_P, EEM_LVDS0_N, EEM_LVDS1_P, EEM_LVDS1_N, EEM_LVDS2_P, EEM_LVDS2_N, EEM_LVDS3_P, EEM_LVDS3_N, EEM_LVDS4_P, EEM_LVDS4_N, EEM_LVDS5_P, EEM_LVDS5_N, EEM_LVDS6_P, EEM_LVDS6_N, EEM_LVDS7_P, EEM_LVDS7_N
EEM_LVDS_B: EEM_LVDS8_P, EEM_LVDS8_N, EEM_LVDS9_P, EEM_LVDS9_N, EEM_LVDS10_P, EEM_LVDS10_N, EEM_LVDS11_P, EEM_LVDS11_N, EEM_LVDS12_P, EEM_LVDS12_N, EEM_LVDS13_P, EEM_LVDS13_N, EEM_LVDS14_P, EEM_LVDS14_N, EEM_LVDS15_P, EEM_LVDS15_N

### Nets
GND: J7.1 J7.4 J7.7 J7.10 J7.13 J7.16 J7.19 J7.22 J7.25 J8.1 J8.4 J8.7 J8.10 J8.13 J8.16 J8.19 J8.22 J8.25
P3V3_DIOT: J7.30 J8.30
EEM0_I2C.SCL: J7.27 ; port EEM_SYSTEM.EEM0_I2C.SCL
EEM0_I2C.SDA: J7.26 ; port EEM_SYSTEM.EEM0_I2C.SDA
EEM1_I2C.SCL: J8.27 ; port EEM_SYSTEM.EEM1_I2C.SCL
EEM1_I2C.SDA: J8.26 ; port EEM_SYSTEM.EEM1_I2C.SDA
EEM_12V: J7.28 J7.29 J8.28 J8.29 ; port EEM_PWR
EEM_LVDS0_N: J7.3 ; port EEM_LVDS_A.EEM_LVDS0_N
EEM_LVDS0_P: J7.2 ; port EEM_LVDS_A.EEM_LVDS0_P
EEM_LVDS1_N: J7.6 ; port EEM_LVDS_A.EEM_LVDS1_N
EEM_LVDS1_P: J7.5 ; port EEM_LVDS_A.EEM_LVDS1_P
EEM_LVDS2_N: J7.9 ; port EEM_LVDS_A.EEM_LVDS2_N
EEM_LVDS2_P: J7.8 ; port EEM_LVDS_A.EEM_LVDS2_P
EEM_LVDS3_N: J7.12 ; port EEM_LVDS_A.EEM_LVDS3_N
EEM_LVDS3_P: J7.11 ; port EEM_LVDS_A.EEM_LVDS3_P
EEM_LVDS4_N: J7.15 ; port EEM_LVDS_A.EEM_LVDS4_N
EEM_LVDS4_P: J7.14 ; port EEM_LVDS_A.EEM_LVDS4_P
EEM_LVDS5_N: J7.18 ; port EEM_LVDS_A.EEM_LVDS5_N
EEM_LVDS5_P: J7.17 ; port EEM_LVDS_A.EEM_LVDS5_P
EEM_LVDS6_N: J7.21 ; port EEM_LVDS_A.EEM_LVDS6_N
EEM_LVDS6_P: J7.20 ; port EEM_LVDS_A.EEM_LVDS6_P
EEM_LVDS7_N: J7.24 ; port EEM_LVDS_A.EEM_LVDS7_N
EEM_LVDS7_P: J7.23 ; port EEM_LVDS_A.EEM_LVDS7_P
EEM_LVDS8_N: J8.3 ; port EEM_LVDS_B.EEM_LVDS8_N
EEM_LVDS8_P: J8.2 ; port EEM_LVDS_B.EEM_LVDS8_P
EEM_LVDS9_N: J8.6 ; port EEM_LVDS_B.EEM_LVDS9_N
EEM_LVDS9_P: J8.5 ; port EEM_LVDS_B.EEM_LVDS9_P
EEM_LVDS10_N: J8.9 ; port EEM_LVDS_B.EEM_LVDS10_N
EEM_LVDS10_P: J8.8 ; port EEM_LVDS_B.EEM_LVDS10_P
EEM_LVDS11_N: J8.12 ; port EEM_LVDS_B.EEM_LVDS11_N
EEM_LVDS11_P: J8.11 ; port EEM_LVDS_B.EEM_LVDS11_P
EEM_LVDS12_N: J8.15 ; port EEM_LVDS_B.EEM_LVDS12_N
EEM_LVDS12_P: J8.14 ; port EEM_LVDS_B.EEM_LVDS12_P
EEM_LVDS13_N: J8.18 ; port EEM_LVDS_B.EEM_LVDS13_N
EEM_LVDS13_P: J8.17 ; port EEM_LVDS_B.EEM_LVDS13_P
EEM_LVDS14_N: J8.21 ; port EEM_LVDS_B.EEM_LVDS14_N
EEM_LVDS14_P: J8.20 ; port EEM_LVDS_B.EEM_LVDS14_P
EEM_LVDS15_N: J8.24 ; port EEM_LVDS_B.EEM_LVDS15_N
EEM_LVDS15_P: J8.23 ; port EEM_LVDS_B.EEM_LVDS15_P

### Layout directives
differential pair; net class LVDS; differential pair class LVDS_DIFF: EEM_LVDS0_N, EEM_LVDS0_P, EEM_LVDS1_N, EEM_LVDS1_P, EEM_LVDS2_N, EEM_LVDS2_P, EEM_LVDS3_N, EEM_LVDS3_P, EEM_LVDS4_N, EEM_LVDS4_P, EEM_LVDS5_N, EEM_LVDS5_P, EEM_LVDS6_N, EEM_LVDS6_P, EEM_LVDS7_N, EEM_LVDS7_P, EEM_LVDS8_N, EEM_LVDS8_P, EEM_LVDS9_N, EEM_LVDS9_P, EEM_LVDS10_N, EEM_LVDS10_P, EEM_LVDS11_N, EEM_LVDS11_P, EEM_LVDS12_N, EEM_LVDS12_P, EEM_LVDS13_N, EEM_LVDS13_P, EEM_LVDS14_N, EEM_LVDS14_P, EEM_LVDS15_N, EEM_LVDS15_P

### Library data of the parts
J7 J8 = 3M_N2530-6002RB: Connector 30 Male; Part Description: 30 Contacts - Straight .100'' x .100'' Low Profile Four-Wall Header, 2500 Series; Manufacturer: 3M; PressFit: No; Part Number: 3M_N2530-6002RB; Component Kind: Standard; Component Type: Standard; Pin Count: 30; Family: Header 30; Mounted: Yes; Socket: No; SMD: No; Sense: No; Status: None; Manufacturer Part Number: N2530-6002RB; ComponentHeight: 10.03mm; HelpURL: \\cern.ch\dfs\Applications\Altium\Datasheets\3M_N2530-6002RB.pdf; Author: CERN DEM JLC; CreateDate: 11.02.2009; LatestRevisionDate: 11.08.2009